# EAGLE schematic BeagleBone_Black_Rev C EAGLE PCB (EAGLE 7.4.0), part 1 of 2

## Sheet 1 of 11
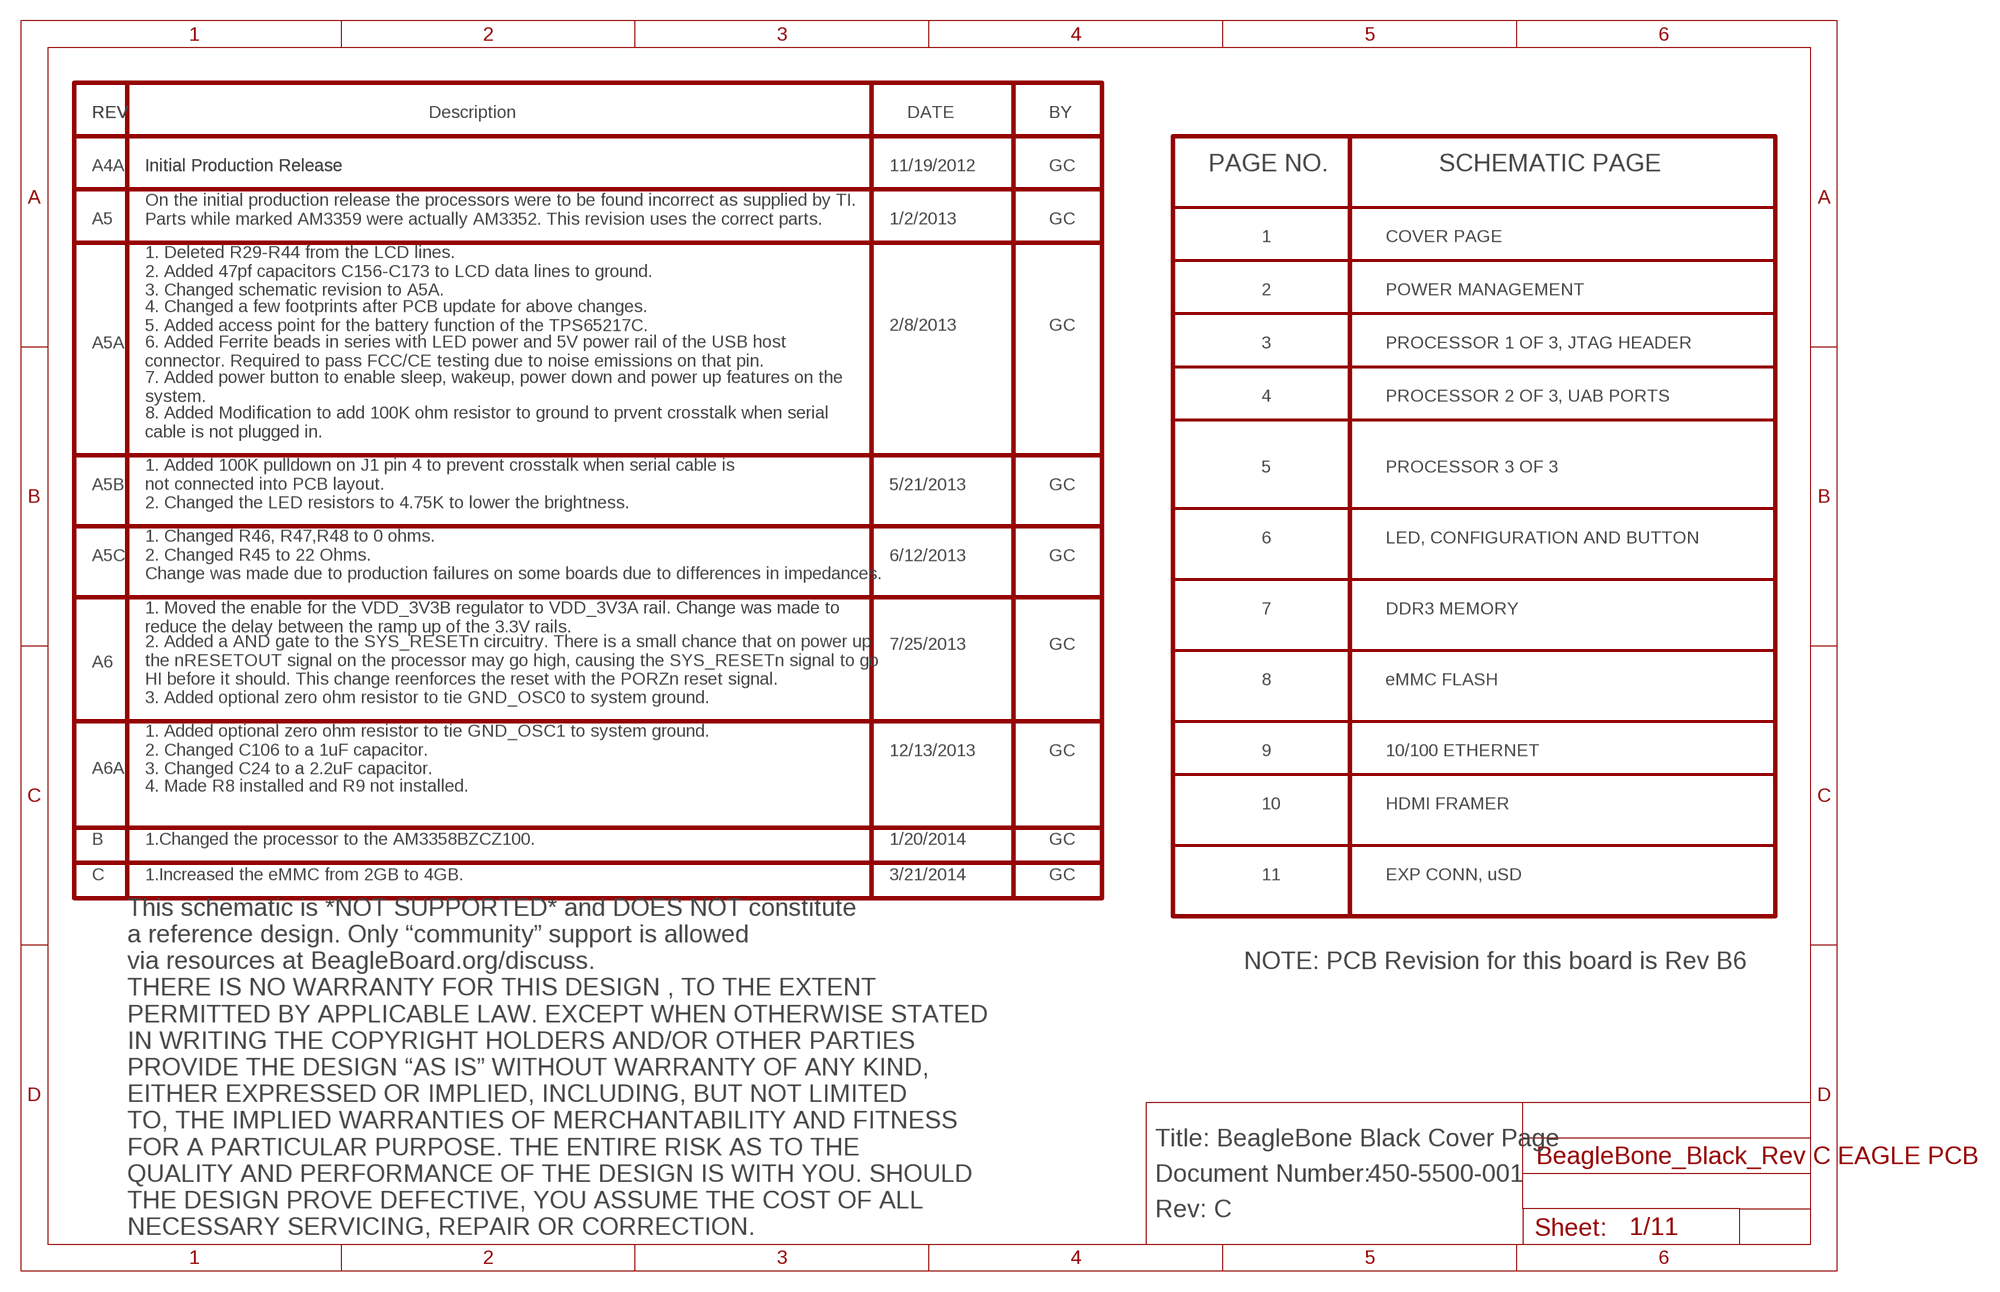
[diagram p0: schematic, sheet 1]

### Notes on the sheet
- REV | REV | Description | DATE | BY
- A4A | Initial Production Release | Initial Production Release | 11/19/2012 | GC | PAGE NO. | SCHEMATIC PAGE
- A5
- On the initial production release the processors were to be found incorrect as supplied by TI.
  Parts while marked AM3359 were actually AM3352. This revision uses the correct parts.
- 1/2/2013 | GC
- 1 | COVER PAGE
- 1. Deleted R29-R44 from the LCD lines.
  2. Added 47pf capacitors C156-C173 to LCD data lines to ground.
  3. Changed schematic revision to A5A.
- 2 | POWER MANAGEMENT
- 4. Changed a few footprints after PCB update for above changes.
  5. Added access point for the battery function of the TPS65217C.
- 2/8/2013 | GC
- A5A | 3 | PROCESSOR 1 OF 3, JTAG HEADER
- 6. Added Ferrite beads in series with LED power and 5V power rail of the USB host
  connector. Required to pass FCC/CE testing due to noise emissions on that pin.
- 7. Added power button to enable sleep, wakeup, power down and power up features on the
  system.
- 4 | PROCESSOR 2 OF 3, UAB PORTS
- 8. Added Modification to add 100K ohm resistor to ground to prvent crosstalk when serial
  cable is not plugged in.
- 5 | PROCESSOR 3 OF 3
- A5B | 5/21/2013 | GC
- 1. Added 100K pulldown on J1 pin 4 to prevent crosstalk when serial cable is
  not connected into PCB layout.
  2. Changed the LED resistors to 4.75K to lower the brightness.
- 6 | LED, CONFIGURATION AND BUTTON
- A5C | 6/12/2013 | GC
- 1. Changed R46, R47,R48 to 0 ohms.
  2. Changed R45 to 22 Ohms.
  Change was made due to production failures on some boards due to differences in impedances.
- 7 | DDR3 MEMORY
- 1. Moved the enable for the VDD_3V3B regulator to VDD_3V3A rail. Change was made to
  reduce the delay between the ramp up of the 3.3V rails.
- 7/25/2013 | GC
- A6
- 8 | eMMC FLASH
- 2. Added a AND gate to the SYS_RESETn circuitry. There is a small chance that on power up
  the nRESETOUT signal on the processor may go high, causing the SYS_RESETn signal to go
  HI before it should. This change reenforces the reset with the PORZn reset signal.
  3. Added optional zero ohm resistor to tie GND_OSC0 to system ground.
- 12/13/2013 | GC | 9 | 10/100 ETHERNET
- A6A
- 1. Added optional zero ohm resistor to tie GND_OSC1 to system ground.
  2. Changed C106 to a 1uF capacitor.
  3. Changed C24 to a 2.2uF capacitor.
- 4. Made R8 installed and R9 not installed.
- 10 | HDMI FRAMER
- B | 1.Changed the processor to the AM3358BZCZ100. | 1/20/2014 | GC
- C | 1.Increased the eMMC from 2GB to 4GB. | 3/21/2014 | GC | 11 | EXP CONN, uSD
- NOTE: PCB Revision for this board is Rev B6
- Title: BeagleBone Black Cover Page
- Document Number: | 450-5500-001
- Rev: C
- This schematic is *NOT SUPPORTED* and DOES NOT constitute
  a reference design. Only “community” support is allowed
  via resources at BeagleBoard.org/discuss.
  THERE IS NO WARRANTY FOR THIS DESIGN , TO THE EXTENT
  PERMITTED BY APPLICABLE LAW. EXCEPT WHEN OTHERWISE STATED
  IN WRITING THE COPYRIGHT HOLDERS AND/OR OTHER PARTIES
  PROVIDE THE DESIGN “AS IS” WITHOUT WARRANTY OF ANY KIND,
  EITHER EXPRESSED OR IMPLIED, INCLUDING, BUT NOT LIMITED
  TO, THE IMPLIED WARRANTIES OF MERCHANTABILITY AND FITNESS
  FOR A PARTICULAR PURPOSE. THE ENTIRE RISK AS TO THE
  QUALITY AND PERFORMANCE OF THE DESIGN IS WITH YOU. SHOULD
  THE DESIGN PROVE DEFECTIVE, YOU ASSUME THE COST OF ALL
  NECESSARY SERVICING, REPAIR OR CORRECTION.

## Sheet 2 of 11
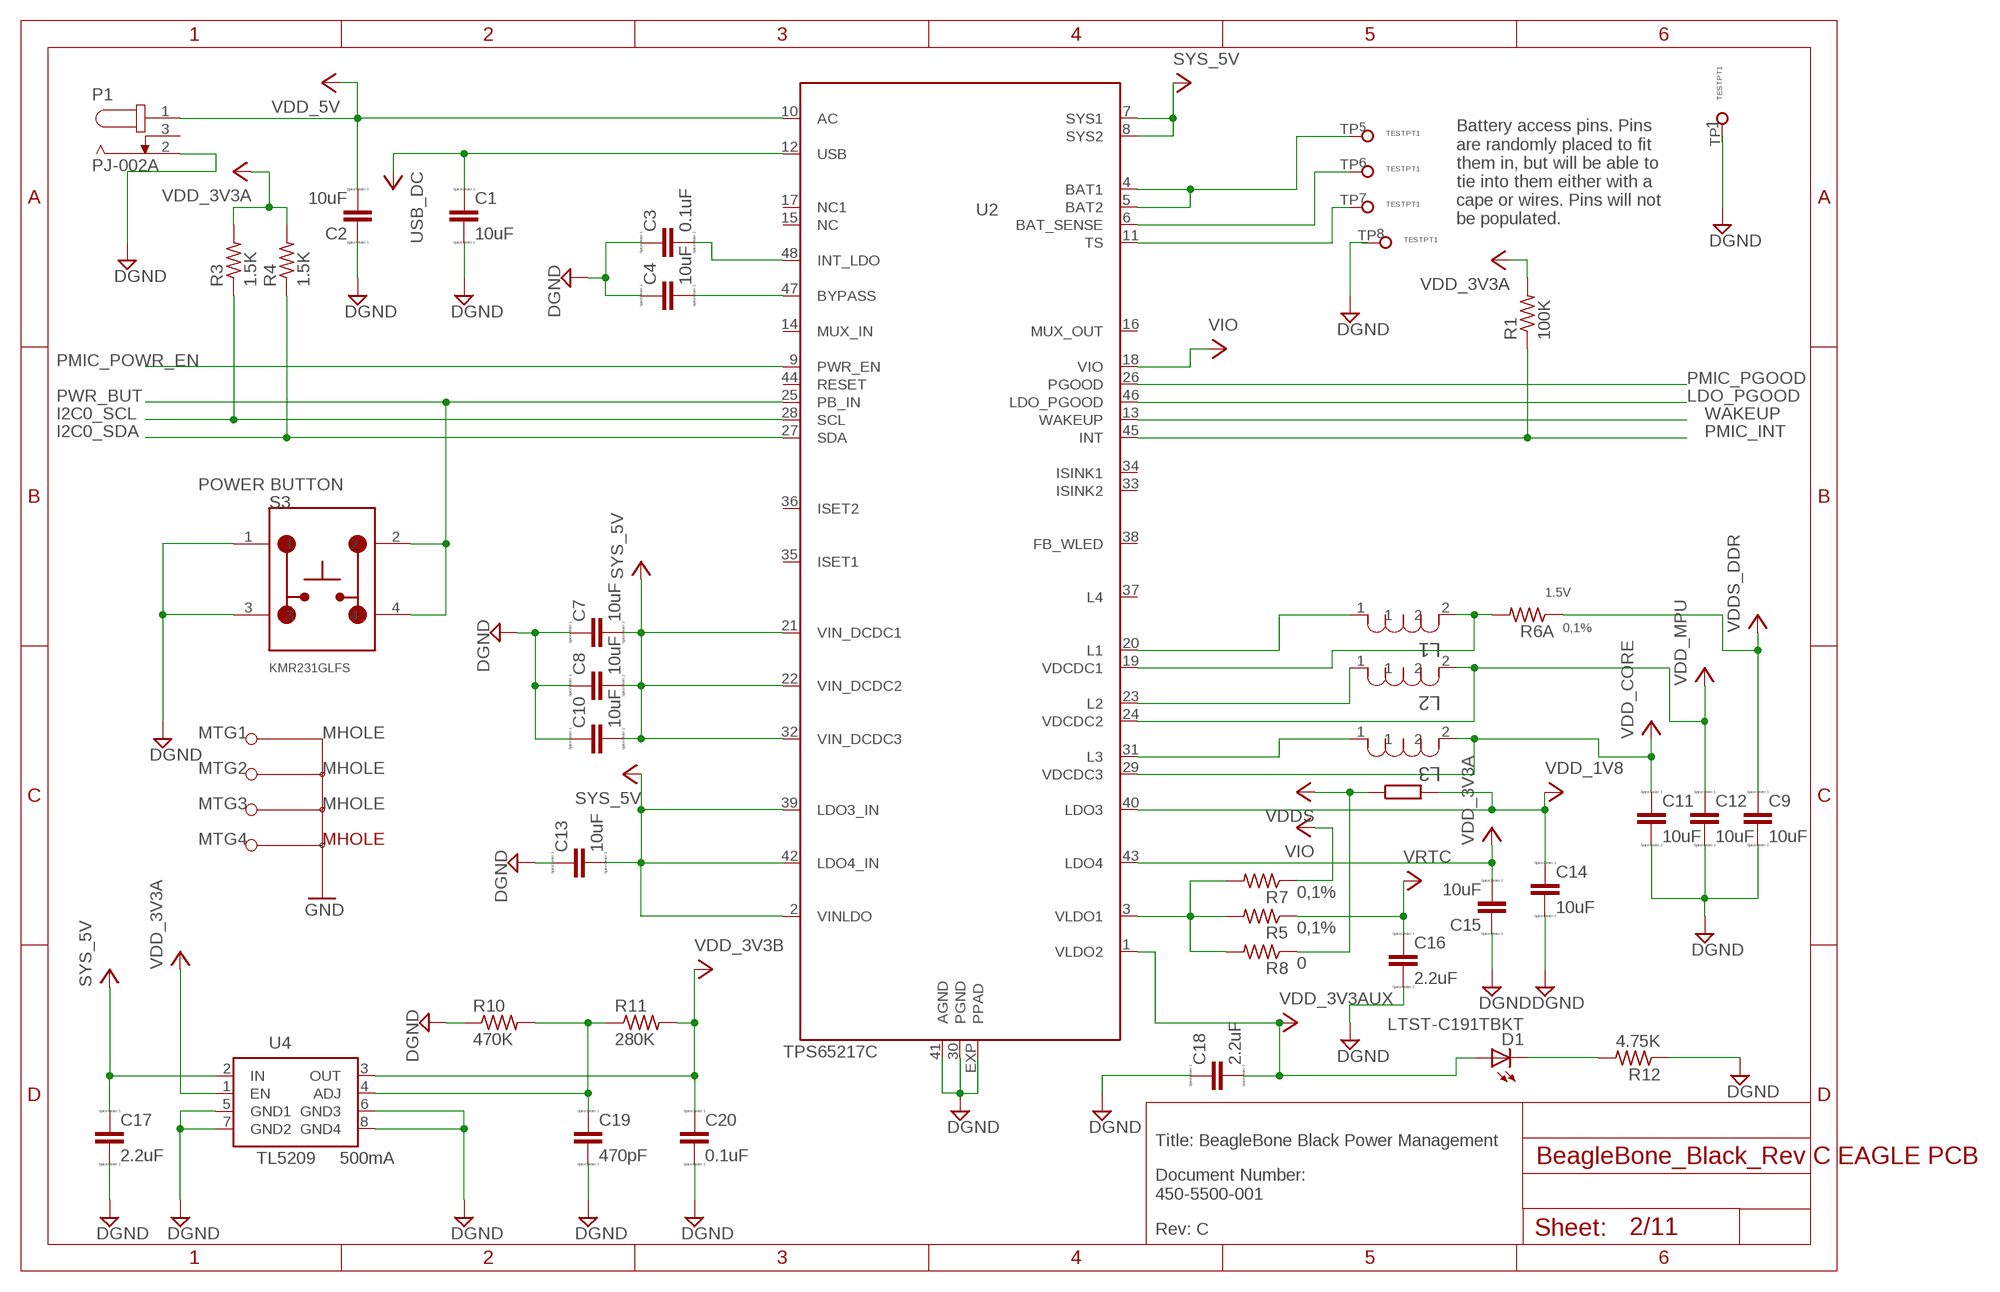
[diagram p1: schematic, sheet 2]

### Parts
C1  10uF  C  [C0805]
C2  10uF  C  [C0805]
C3  0.1uF  CC0402  [C0402]
C4  10uF  C  [C0805]
C7  10uF  C  [C0805]
C8  10uF  C  [C0805]
C9  10uF  C  [C0805]
C10  10uF  C  [C0805]
C11  10uF  C  [C0805]
C12  10uF  C  [C0805]
C13  10uF  C  [C0805]
C14  10uF  C  [C0805]
C15  10uF  C  [C0805]
C16  2.2uF  CC0402  [C0402]
C17  2.2uF  CC0402  [C0402]
C18  2.2uF  CC0402  [C0402]
C19  470pF  CC0402  [C0402]
C20  0.1uF  CC0402  [C0402]
D1  LTST-C191TBKT  LEDSML0603  [SML0603]
L1  LQM2HPN2RMG0L  [LQM2HPN2R2MG0L]
L2  LQM2HPN2RMG0L  [LQM2HPN2R2MG0L]
L3  LQM2HPN2RMG0L  [LQM2HPN2R2MG0L]
R1  100K  R-US_R0402  [R0402]
R3  1.5K  R-US_R0402  [R0402]
R4  1.5K  R-US_R0402  [R0402]
R5  R-US_R0402  [R0402]
R6A  R-US_R0402  [R0402]
R7  R-US_R0402  [R0402]
R8  R-US_R0402  [R0402]
R10  470K  R-US_R0402  [R0402]
R11  280K  R-US_R0402  [R0402]
R12  4.75K  R-US_R0402  [R0402]
S3  KMR231GLFS  [KMR231GLFS]
TP5  TESTPOINT  [TESTPOINT]
TP6  TESTPOINT  [TESTPOINT]
TP7  TESTPOINT  [TESTPOINT]
TP8  TESTPOINT  [TESTPOINT]
TP12  TESTPOINT  [TESTPOINT]
U4  TL5209  [TL5209]
U$1  PJ-002A  [PJ-002A]
U$3  TPS65217C  [TPS65217C]

### Nets
GND: C1.2 C2.1 C3.1 C4.1 C7.1 C8.1 C9.2 C10.1 C11.2 C12.2 C13.1 C14.2 C15.1 C16.2 C17.2 C18.1 C19.2 C20.2 R10.1 R12.1 S3.1 S3.3 U4.5(GND1) U4.6(GND3) U4.7(GND2) U4.8(GND4) U$1.2 U$3.30(PGND) U$3.41(AGND) U$3.EXP(PPAD) ; supply symbol labelled DGND ; also sheet 3,4,5,6,7,8,9,10,11
I2C0_SCL: R3.1 U$3.28(SCL) ; also sheet 4,10,11
I2C0_SDA: R4.1 U$3.27(SDA) ; also sheet 4,10,11
LDO_PGOOD: U$3.46(LDO_PGOOD) ; also sheet 3
N$1: C3.2 U$3.48(INT_LDO)
N$2: C19.1 R10.2 R11.1 U4.4(ADJ)
N$3: C4.2 U$3.47(BYPASS)
N$5: U$3.4(BAT1) U$3.5(BAT2)
N$8: L1.1 U$3.20(L1)
N$9: R5.2 R7.2 R8.2 U$3.3(VLDO1)
N$10: U$3.6(BAT_SENSE)
N$11: U$3.11(TS)
N$17: D1.C R12.2
N$19: L3.1 U$3.31(L3)
N$464: L1.2 R6A.2 U$3.19(VDCDC1)
N$465: L2.1 U$3.23(L2)
PMIC_INT: R1.1 U$3.45(INT) ; also sheet 3
PMIC_PGOOD: U$3.26(PGOOD) ; also sheet 3
PMIC_POWR_EN: U$3.9(PWR_EN) ; also sheet 4
PWR_BUT: S3.2 S3.4 U$3.25(PB_IN) ; also sheet 11
VCC: C1.1 C2.2 C7.2 C8.2 C9.1 C10.2 C11.1 C12.1 C13.2 C14.1 C15.2 C16.1 C17.1 C18.2 C20.1 D1.A L2.2 L3.2 R1.2 R3.2 R4.2 R5.1 R6A.1 R7.1 R8.1 R11.2 U4.1(EN) U4.2(IN) U4.3(OUT) U$1.1 U$3.1(VLDO2) U$3.2(VINLDO) U$3.7(SYS1) U$3.8(SYS2) U$3.10(AC) U$3.12(USB) U$3.18(VIO) U$3.21(VIN_DCDC1) U$3.22(VIN_DCDC2) U$3.24(VDCDC2) U$3.29(VDCDC3) U$3.32(VIN_DCDC3) U$3.39(LDO3_IN) U$3.40(LDO3) U$3.42(LDO4_IN) U$3.43(LDO4) ; supply symbol labelled SYS_5V, VDD_3V3A, VDD_3V3B, VDD_5V, USB_DC, VIO, VRTC, VDDS, VDD_1V8, VDD_CORE, VDD_MPU, VDDS_DDR, VDD_3V3AUX ; also sheet 3,4,5,6,7,8,9,10,11
WAKEUP: U$3.13(WAKEUP) ; also sheet 4
Unconnected: TP5.TP TP6.TP TP7.TP TP8.TP TP12.TP U$1.3 U$3.14(MUX_IN) U$3.15(NC) U$3.16(MUX_OUT) U$3.17(NC1) U$3.33(ISINK2) U$3.34(ISINK1) U$3.35(ISET1) U$3.36(ISET2) U$3.37(L4) U$3.38(FB_WLED) U$3.44(RESET)

### Notes on the sheet
- 5 | 1
- 6
- 7
- Battery access pins. Pins
  are randomly placed to fit
  them in, but will be able to
  tie into them either with a
  cape or wires. Pins will not
  be populated.
- 8
- POWER BUTTON
- S3
- 1.5V
- 0,1%
- MTG1 | MHOLE
- MTG2 | MHOLE
- MTG3 | MHOLE
- MTG4 | MHOLE
- 0,1%
- 0,1%
- 0
- TPS65217C
- Title: BeagleBone Black Power Management
- 500mA
- Document Number:
  450-5500-001
- Rev: C

## Sheet 3 of 11
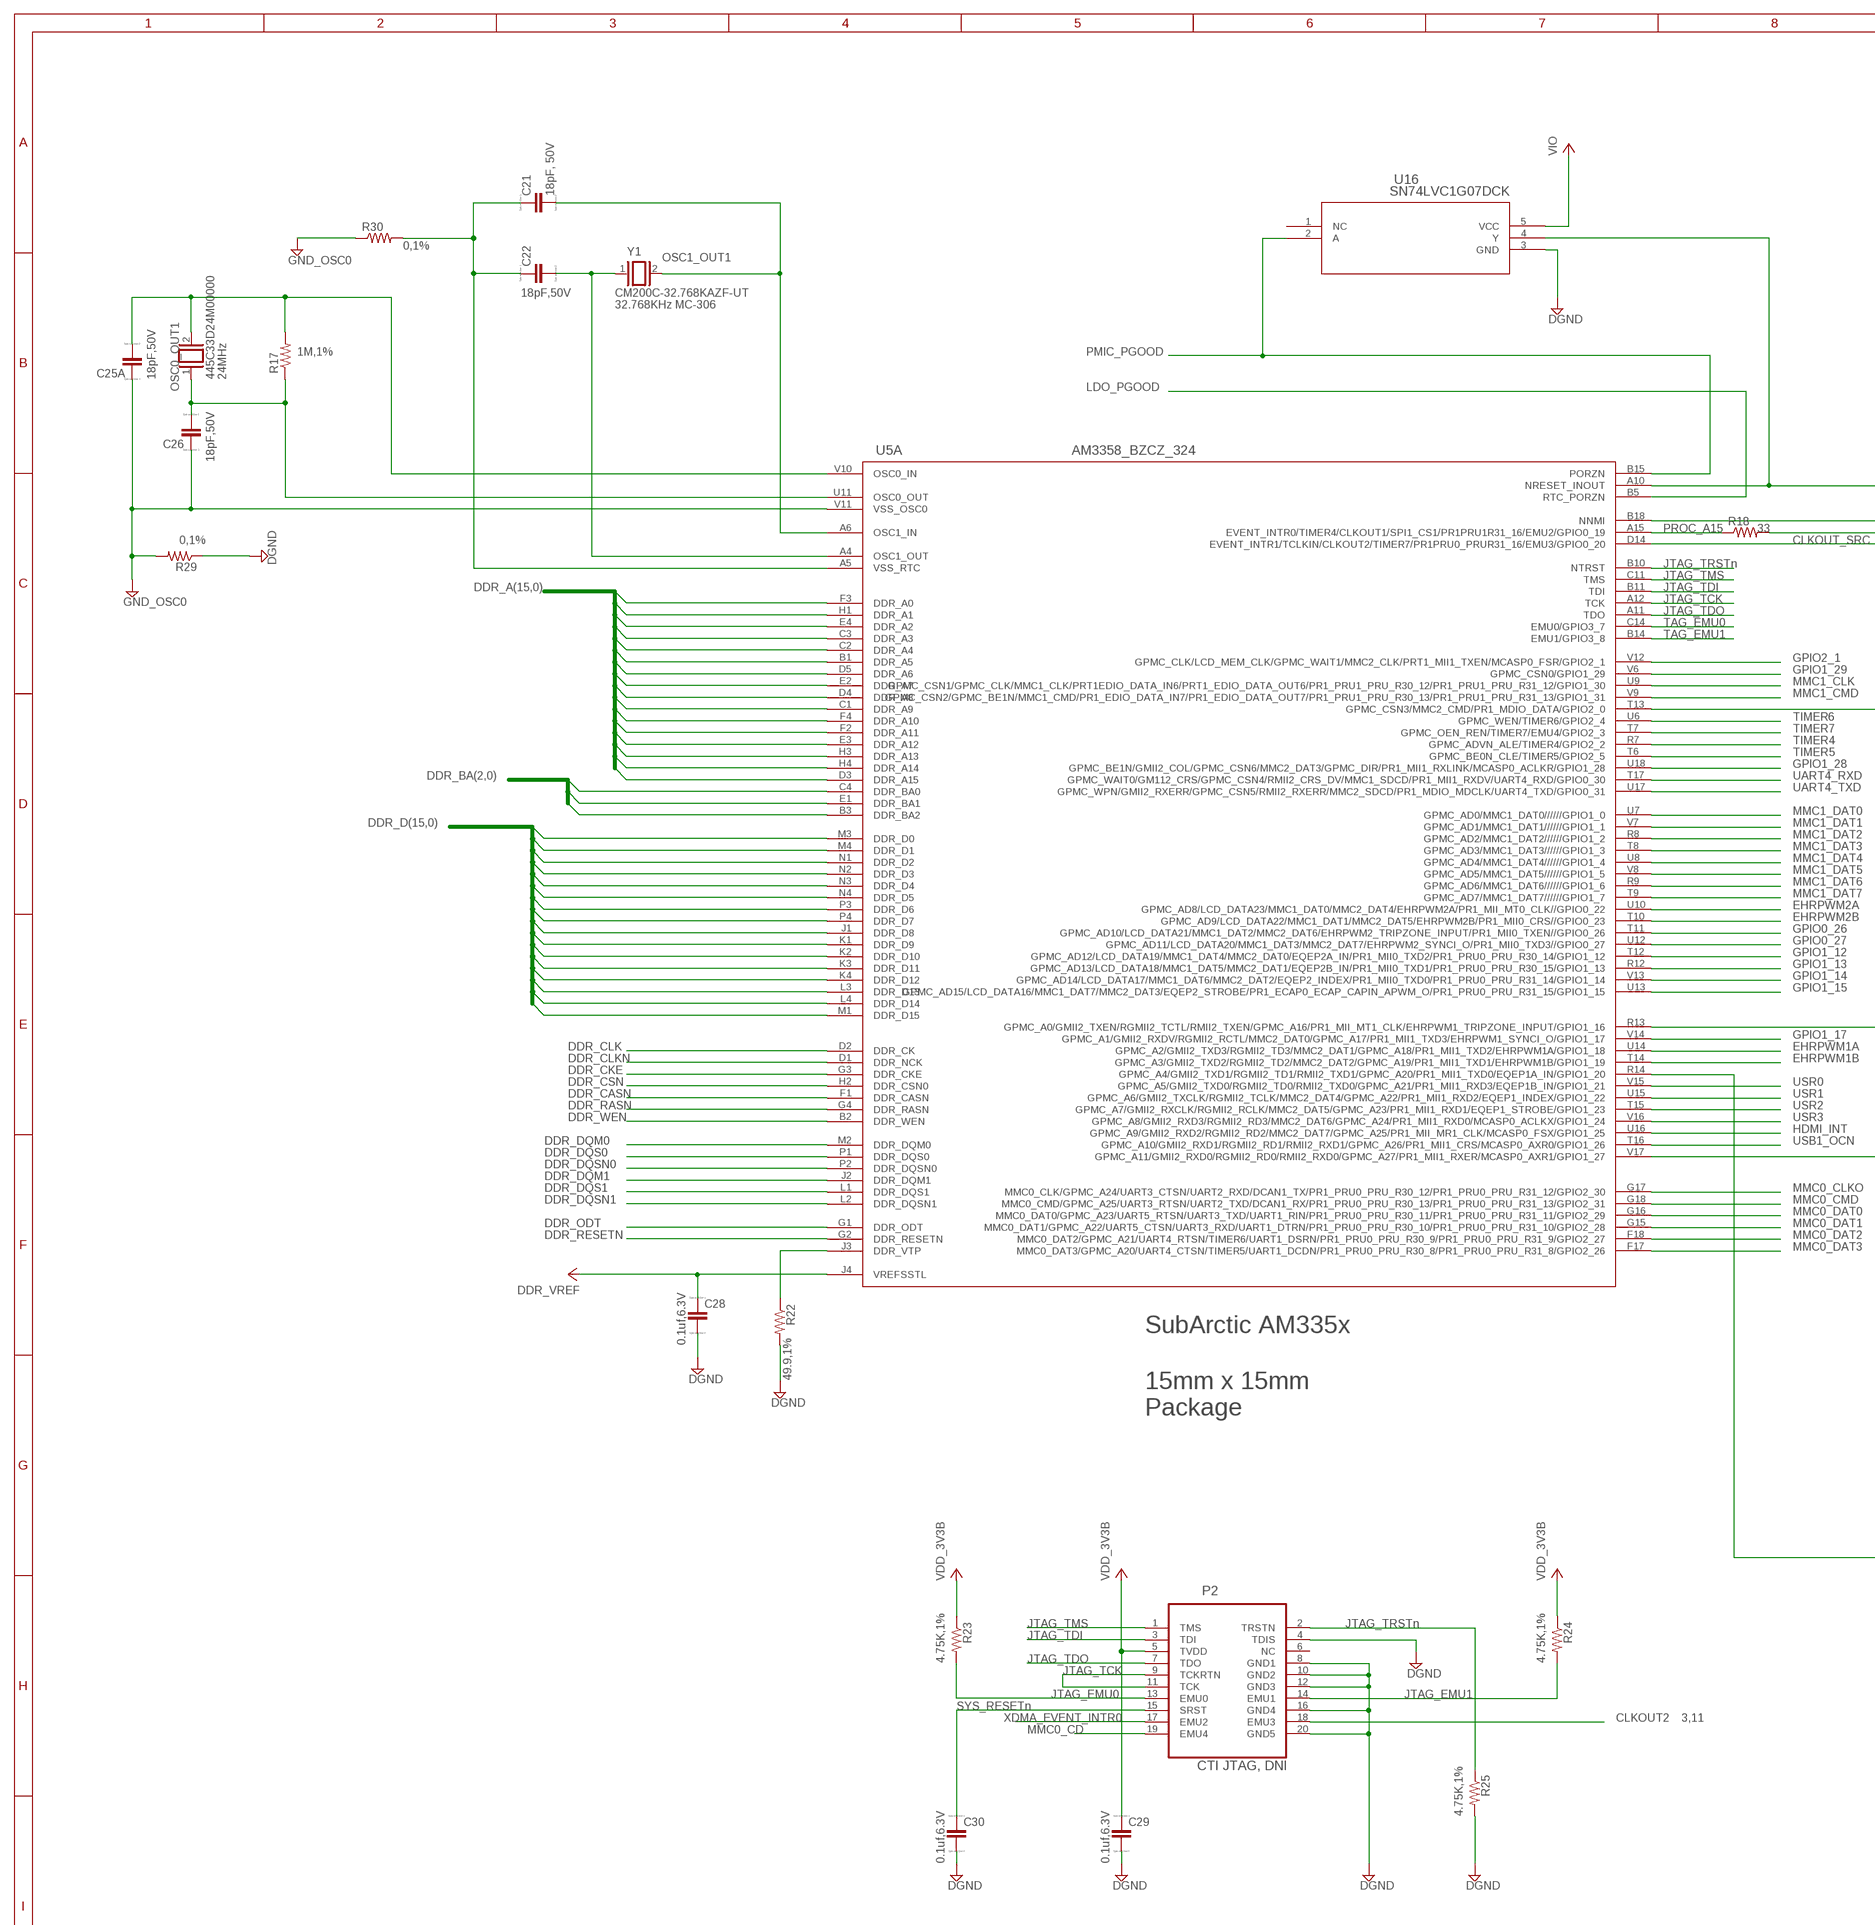
[diagram p2: schematic, sheet 3, part 1 of 2]
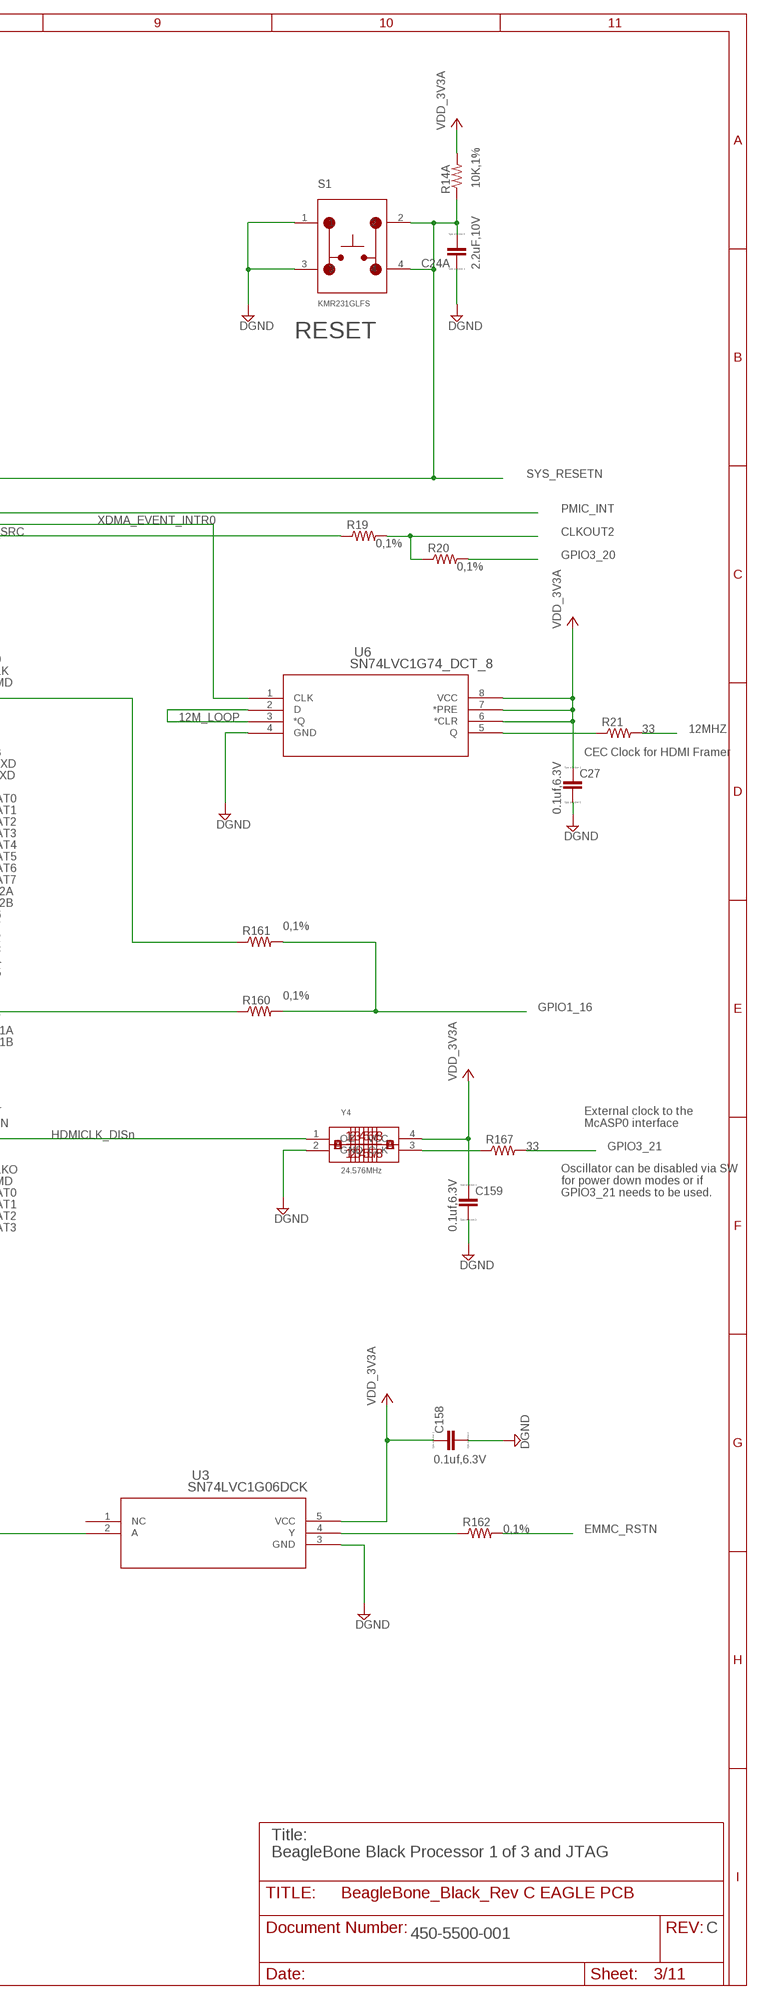
[diagram p3: schematic, sheet 3, part 2 of 2]

### Parts
C21  18pF, 50V  CC0402  [C0402]
C22  CC0402  [C0402]
C24A  CC0402  [C0402]
C25A  CC0402  [C0402]
C26  CC0402  [C0402]
C27  CC0402  [C0402]
C28  CC0402  [C0402]
C29  CC0402  [C0402]
C30  CC0402  [C0402]
C158  CC0402  [C0402]
C159  CC0402  [C0402]
P2  CTIJTAG  [CTIJTAG]
R14A  R-US_R0402  [R0402]
R17  R-US_R0402  [R0402]
R18  R-US_R0402  [R0402]
R19  R-US_R0402  [R0402]
R20  R-US_R0402  [R0402]
R21  R-US_R0402  [R0402]
R22  R-US_R0402  [R0402]
R23  R-US_R0402  [R0402]
R24  R-US_R0402  [R0402]
R25  R-US_R0402  [R0402]
R29  R-US_R0402  [R0402]
R30  R-US_R0402  [R0402]
R160  R-US_R0402  [R0402]
R161  R-US_R0402  [R0402]
R162  R-US_R0402  [R0402]
R167  R-US_R0402  [R0402]
S1  KMR231GLFS  [KMR231GLFS]
U3  SN74LVC1G06DCK  SN74LVC1G06_DCK_5  [DCK5]
U5  AM3358_BZCZ_324  [BZCZ324]
U6  SN74LVC1G74_DCT_8  [DCT8]
U16  SN74LVC1G07DCK  SN74LVC1G07_DCK_5  [DCK5]
Y1  CM200C-32.768KAZF-UT  [CM200C-32.768KAZF-UT]
Y2  445C33D24M00000  [445C33D24M00000]
Y4  ASDMB-24.576MHZ-LC-T  [ASDMB-24.576MHZ-LC-T]

### Nets
12MHZ: R21.2 ; also sheet 10
CLKOUT2: P2.18(EMU3) R19.2 R20.1 ; also sheet 11
DDR_A(15,0): U5.B1(DDR_A5) U5.C1(DDR_A9) U5.C2(DDR_A4) U5.C3(DDR_A3) U5.D3(DDR_A15) U5.D4(DDR_A8) U5.D5(DDR_A6) U5.E2(DDR_A7) U5.E3(DDR_A12) U5.E4(DDR_A2) U5.F2(DDR_A11) U5.F3(DDR_A0) U5.F4(DDR_A10) U5.H1(DDR_A1) U5.H3(DDR_A13) U5.H4(DDR_A14) ; also sheet 7
DDR_BA(2,0): U5.B3(DDR_BA2) U5.C4(DDR_BA0) U5.E1(DDR_BA1) ; also sheet 7
DDR_CASN: U5.F1(DDR_CASN) ; also sheet 7
DDR_CKE: U5.G3(DDR_CKE) ; also sheet 7
DDR_CLK: U5.D2(DDR_CK) ; also sheet 7
DDR_CLKN: U5.D1(DDR_NCK) ; also sheet 7
DDR_CSN: U5.H2(DDR_CSN0) ; also sheet 7
DDR_D(15,0): U5.J1(DDR_D8) U5.K1(DDR_D9) U5.K2(DDR_D10) U5.K3(DDR_D11) U5.K4(DDR_D12) U5.L3(DDR_D13) U5.L4(DDR_D14) U5.M1(DDR_D15) U5.M3(DDR_D0) U5.M4(DDR_D1) U5.N1(DDR_D2) U5.N2(DDR_D3) U5.N3(DDR_D4) U5.N4(DDR_D5) U5.P3(DDR_D6) U5.P4(DDR_D7) ; also sheet 7
DDR_DQM0: U5.M2(DDR_DQM0) ; also sheet 7
DDR_DQM1: U5.J2(DDR_DQM1) ; also sheet 7
DDR_DQS0: U5.P1(DDR_DQS0) ; also sheet 7
DDR_DQS1: U5.L1(DDR_DQS1) ; also sheet 7
DDR_DQSN0: U5.P2(DDR_DQSN0) ; also sheet 7
DDR_DQSN1: U5.L2(DDR_DQSN1) ; also sheet 7
DDR_ODT: U5.G1(DDR_ODT) ; also sheet 7
DDR_RASN: U5.G4(DDR_RASN) ; also sheet 7
DDR_RESETN: U5.G2(DDR_RESETN) ; also sheet 7
DDR_WEN: U5.B2(DDR_WEN) ; also sheet 7
EHRPWM1A: U5.U14(GPMC_A2/GMII2_TXD3/RGMII2_TD3/MMC2_DAT1/GPMC_A18/PR1_MII1_TXD2/EHRPWM1A/GPIO1_18) ; also sheet 11
EHRPWM1B: U5.T14(GPMC_A3/GMII2_TXD2/RGMII2_TD2/MMC2_DAT2/GPMC_A19/PR1_MII1_TXD1/EHRPWM1B/GPIO1_19) ; also sheet 11
EHRPWM2A: U5.U10(GPMC_AD8/LCD_DATA23/MMC1_DAT0/MMC2_DAT4/EHRPWM2A/PR1_MII_MT0_CLK//GPIO0_22) ; also sheet 11
EHRPWM2B: U5.T10(GPMC_AD9/LCD_DATA22/MMC1_DAT1/MMC2_DAT5/EHRPWM2B/PR1_MII0_CRS//GPIO0_23) ; also sheet 11
EMMC_RSTN: R162.2 ; also sheet 8
GND: C24A.1 C25A.1 C26.1 C27.2 C28.2 C29.2 C30.2 C158.2 C159.2 P2.4(TDIS) P2.8(GND1) P2.10(GND2) P2.12(GND3) P2.16(GND4) P2.20(GND5) R22.2 R25.2 R29.1 R29.2 R30.1 S1.1 S1.3 U3.3(GND) U5.V11(VSS_OSC0) U6.4(GND) U16.3(GND) Y4.2(GND) ; supply symbol labelled DGND, GND_OSC0 ; also sheet 2,4,5,6,7,8,9,10,11
GPIO0_26: U5.T11(GPMC_AD10/LCD_DATA21/MMC1_DAT2/MMC2_DAT6/EHRPWM2_TRIPZONE_INPUT/PR1_MII0_TXEN//GPIO0_26) ; also sheet 11
GPIO0_27: U5.U12(GPMC_AD11/LCD_DATA20/MMC1_DAT3/MMC2_DAT7/EHRPWM2_SYNCI_O/PR1_MII0_TXD3//GPIO0_27) ; also sheet 11
GPIO1_12: U5.T12(GPMC_AD12/LCD_DATA19/MMC1_DAT4/MMC2_DAT0/EQEP2A_IN/PR1_MII0_TXD2/PR1_PRU0_PRU_R30_14/GPIO1_12) ; also sheet 11
GPIO1_13: U5.R12(GPMC_AD13/LCD_DATA18/MMC1_DAT5/MMC2_DAT1/EQEP2B_IN/PR1_MII0_TXD1/PR1_PRU0_PRU_R30_15/GPIO1_13) ; also sheet 11
GPIO1_14: U5.V13(GPMC_AD14/LCD_DATA17/MMC1_DAT6/MMC2_DAT2/EQEP2_INDEX/PR1_MII0_TXD0/PR1_PRU0_PRU_R31_14/GPIO1_14) ; also sheet 11
GPIO1_15: U5.U13(GPMC_AD15/LCD_DATA16/MMC1_DAT7/MMC2_DAT3/EQEP2_STROBE/PR1_ECAP0_ECAP_CAPIN_APWM_O/PR1_PRU0_PRU_R31_15/GPIO1_15) ; also sheet 11
GPIO1_16: R160.2 R161.2 ; also sheet 11
GPIO1_17: U5.V14(GPMC_A1/GMII2_RXDV/RGMII2_RCTL/MMC2_DAT0/GPMC_A17/PR1_MII1_TXD3/EHRPWM1_SYNCI_O/GPIO1_17) ; also sheet 11
GPIO1_28: U5.U18(GPMC_BE1N/GMII2_COL/GPMC_CSN6/MMC2_DAT3/GPMC_DIR/PR1_MII1_RXLINK/MCASP0_ACLKR/GPIO1_28) ; also sheet 11
GPIO1_29: U5.V6(GPMC_CSN0/GPIO1_29) ; also sheet 11
GPIO2_1: U5.V12(GPMC_CLK/LCD_MEM_CLK/GPMC_WAIT1/MMC2_CLK/PRT1_MII1_TXEN/MCASP0_FSR/GPIO2_1) ; also sheet 11
GPIO3_20: R20.2 ; also sheet 4
GPIO3_21: R167.2 ; also sheet 4,11
HDMI_INT: U5.U16(GPMC_A9/GMII2_RXD2/RGMII2_RD2/MMC2_DAT7/GPMC_A25/PR1_MII_MR1_CLK/MCASP0_FSX/GPIO1_25) ; also sheet 10
LDO_PGOOD: U5.B5(RTC_PORZN) ; also sheet 2
MMC0_CD: P2.19(EMU4) ; also sheet 4,11
MMC0_CLKO: U5.G17(MMC0_CLK/GPMC_A24/UART3_CTSN/UART2_RXD/DCAN1_TX/PR1_PRU0_PRU_R30_12/PR1_PRU0_PRU_R31_12/GPIO2_30)
MMC0_CMD: U5.G18(MMC0_CMD/GPMC_A25/UART3_RTSN/UART2_TXD/DCAN1_RX/PR1_PRU0_PRU_R30_13/PR1_PRU0_PRU_R31_13/GPIO2_31) ; also sheet 11
MMC0_DAT0: U5.G16(MMC0_DAT0/GPMC_A23/UART5_RTSN/UART3_TXD/UART1_RIN/PR1_PRU0_PRU_R30_11/PR1_PRU0_PRU_R31_11/GPIO2_29) ; also sheet 11
MMC0_DAT1: U5.G15(MMC0_DAT1/GPMC_A22/UART5_CTSN/UART3_RXD/UART1_DTRN/PR1_PRU0_PRU_R30_10/PR1_PRU0_PRU_R31_10/GPIO2_28) ; also sheet 11
MMC0_DAT2: U5.F18(MMC0_DAT2/GPMC_A21/UART4_RTSN/TIMER6/UART1_DSRN/PR1_PRU0_PRU_R30_9/PR1_PRU0_PRU_R31_9/GPIO2_27) ; also sheet 11
MMC0_DAT3: U5.F17(MMC0_DAT3/GPMC_A20/UART4_CTSN/TIMER5/UART1_DCDN/PR1_PRU0_PRU_R30_8/PR1_PRU0_PRU_R31_8/GPIO2_26) ; also sheet 11
MMC1_CLK: U5.U9(GPMC_CSN1/GPMC_CLK/MMC1_CLK/PRT1EDIO_DATA_IN6/PRT1_EDIO_DATA_OUT6/PR1_PRU1_PRU_R30_12/PR1_PRU1_PRU_R31_12/GPIO1_30) ; also sheet 8,11
MMC1_CMD: U5.V9(GPMC_CSN2/GPMC_BE1N/MMC1_CMD/PR1_EDIO_DATA_IN7/PR1_EDIO_DATA_OUT7/PR1_PRU1_PRU_R30_13/PR1_PRU1_PRU_R31_13/GPIO1_31) ; also sheet 8,11
MMC1_DAT0: U5.U7(GPMC_AD0/MMC1_DAT0//////GPIO1_0) ; also sheet 8,11
MMC1_DAT1: U5.V7(GPMC_AD1/MMC1_DAT1//////GPIO1_1) ; also sheet 8,11
MMC1_DAT2: U5.R8(GPMC_AD2/MMC1_DAT2//////GPIO1_2) ; also sheet 8,11
MMC1_DAT3: U5.T8(GPMC_AD3/MMC1_DAT3//////GPIO1_3) ; also sheet 8,11
MMC1_DAT4: U5.U8(GPMC_AD4/MMC1_DAT4//////GPIO1_4) ; also sheet 8,11
MMC1_DAT5: U5.V8(GPMC_AD5/MMC1_DAT5//////GPIO1_5) ; also sheet 8,11
MMC1_DAT6: U5.R9(GPMC_AD6/MMC1_DAT6//////GPIO1_6) ; also sheet 8,11
MMC1_DAT7: U5.T9(GPMC_AD7/MMC1_DAT7//////GPIO1_7) ; also sheet 8,11
N$22: R22.1 U5.J3(DDR_VTP)
N$71: C21.2 U5.A6(OSC1_IN) Y1.2
N$72: C22.2 U5.A4(OSC1_OUT) Y1.1
N$73: C21.1 C22.1 R30.2 U5.A5(VSS_RTC)
N$74: C25A.2 R17.2 U5.V10(OSC0_IN) Y2.2
N$76: C26.2 R17.1 U5.U11(OSC0_OUT) Y2.1
N$80: U6.2(D) U6.3(*Q)
N$81: R21.1 U6.5(Q)
N$82: R18.1 U5.A15(EVENT_INTR0/TIMER4/CLKOUT1/SPI1_CS1/PR1PRU1R31_16/EMU2/GPIO0_19)
N$83: R18.2 U6.1(CLK)
N$85: R19.1 U5.D14(EVENT_INTR1/TCLKIN/CLKOUT2/TIMER7/PR1PRU0_PRUR31_16/EMU3/GPIO0_20)
N$88: U5.B10(NTRST)
N$89: U5.C11(TMS)
N$90: U5.B11(TDI)
N$91: U5.A12(TCK)
N$92: U5.A11(TDO)
N$93: U5.C14(EMU0/GPIO3_7)
N$94: U5.B14(EMU1/GPIO3_8)
N$122: R160.1 U5.R13(GPMC_A0/GMII2_TXEN/RGMII2_TCTL/RMII2_TXEN/GPMC_A16/PR1_MII_MT1_CLK/EHRPWM1_TRIPZONE_INPUT/GPIO1_16)
N$123: R161.1 U5.T13(GPMC_CSN3/MMC2_CMD/PR1_MDIO_DATA/GPIO2_0)
N$125: U5.V17(GPMC_A11/GMII2_RXD0/RGMII2_RD0/RMII2_RXD0/GPMC_A27/PR1_MII1_RXER/MCASP0_AXR1/GPIO1_27) Y4.1(OE)
N$128: R167.1 Y4.3(CLK)
N$143: U3.2(A) U5.R14(GPMC_A4/GMII2_TXD1/RGMII2_TD1/RMII2_TXD1/GPMC_A20/PR1_MII1_TXD0/EQEP1A_IN/GPIO1_20)
N$144: R162.1 U3.4(Y)
N$146: P2.9(TCKRTN) P2.11(TCK)
N$147: P2.14(EMU1) R24.2
N$149: P2.2(TRSTN) R25.1
N$150: P2.1(TMS)
N$151: P2.3(TDI)
N$152: P2.7(TDO)
N$153: P2.13(EMU0) R23.2
N$154: C30.1 P2.15(SRST)
N$155: P2.17(EMU2)
PMIC_INT: U5.B18(NNMI) ; also sheet 2
PMIC_PGOOD: U5.B15(PORZN) U16.2(A) ; also sheet 2
SYS_RESETN: C24A.2 R14A.1 S1.2 S1.4 U5.A10(NRESET_INOUT) U16.4(Y) ; also sheet 9,11
TIMER: U5.U6(GPMC_WEN/TIMER6/GPIO2_4)
TIMER4: U5.R7(GPMC_ADVN_ALE/TIMER4/GPIO2_2) ; also sheet 11
TIMER5: U5.T6(GPMC_BE0N_CLE/TIMER5/GPIO2_5) ; also sheet 11
TIMER7: U5.T7(GPMC_OEN_REN/TIMER7/EMU4/GPIO2_3) ; also sheet 11
UART4_RXD: U5.T17(GPMC_WAIT0/GM112_CRS/GPMC_CSN4/RMII2_CRS_DV/MMC1_SDCD/PR1_MII1_RXDV/UART4_RXD/GPIO0_30) ; also sheet 11
UART4_TXD: U5.U17(GPMC_WPN/GMII2_RXERR/GPMC_CSN5/RMII2_RXERR/MMC2_SDCD/PR1_MDIO_MDCLK/UART4_TXD/GPIO0_31) ; also sheet 11
USB1_OCN: U5.T16(GPMC_A10/GMII2_RXD1/RGMII2_RD1/RMII2_RXD1/GPMC_A26/PR1_MII1_CRS/MCASP0_AXR0/GPIO1_26) ; also sheet 4
USR0: U5.V15(GPMC_A5/GMII2_TXD0/RGMII2_TD0/RMII2_TXD0/GPMC_A21/PR1_MII1_RXD3/EQEP1B_IN/GPIO1_21) ; also sheet 6
USR1: U5.U15(GPMC_A6/GMII2_TXCLK/RGMII2_TCLK/MMC2_DAT4/GPMC_A22/PR1_MII1_RXD2/EQEP1_INDEX/GPIO1_22) ; also sheet 6
USR2: U5.T15(GPMC_A7/GMII2_RXCLK/RGMII2_RCLK/MMC2_DAT5/GPMC_A23/PR1_MII1_RXD1/EQEP1_STROBE/GPIO1_23) ; also sheet 6
USR3: U5.V16(GPMC_A8/GMII2_RXD3/RGMII2_RD3/MMC2_DAT6/GPMC_A24/PR1_MII1_RXD0/MCASP0_ACLKX/GPIO1_24) ; also sheet 6
VCC: C27.1 C28.1 C29.1 C158.1 C159.1 P2.5(TVDD) R14A.2 R23.1 R24.1 U3.5(VCC) U5.J4(VREFSSTL) U6.6(*CLR) U6.7(*PRE) U6.8(VCC) U16.5(VCC) Y4.4(VCC) ; supply symbol labelled VIO, VDD_3V3A, VDD_3V3B, DDR_VREF ; also sheet 2,4,5,6,7,8,9,10,11
Unconnected: P2.6(NC) U3.1(NC) U16.1(NC)

### Notes on the sheet
- S1 | 10K,1%
- 0,1%
- OSC1_OUT1
- 2.2uF,10V
- 18pF,50V
- 32.768KHz MC-306
- RESET
- 1M,1%
- 18pF,50V | 24MHz
- OSC0_OUT1
- 18pF,50V
- PROC_A15 | 33 | XDMA_EVENT_INTR0
- 0,1% | CLKOUT_SRC
- 0,1%
- JTAG_TRSTn
- JTAG_TMS | 0,1%
- JTAG_TDI
- JTAG_TCK
- JTAG_TDO
- TAG_EMU0
- TAG_EMU1
- 6
- 12M_LOOP
- 33
- CEC Clock for HDMI Framer
- 0.1uf,6.3V
- 0,1%
- 0,1%
- External clock to the
  McASP0 interface
- HDMICLK_DISn
- 33
- Oscillator can be disabled via SW
  for power down modes or if
  GPIO3_21 needs to be used.
- 0.1uf,6.3V
- SubArctic AM335x
- 0.1uf,6.3V
- 49.9,1%
- 15mm x 15mm
  Package
- 0.1uf,6.3V
- 0,1%
- JTAG_TMS | JTAG_TRSTn
- JTAG_TDI
- 4.75K,1% | JTAG_TDO | 4.75K,1%
- JTAG_TCK
- JTAG_EMU0 | JTAG_EMU1
- SYS_RESETn
- XDMA_EVENT_INTR0 | CLKOUT2    3,11
- MMC0_CD
- 4.75K,1%
- 0.1uf,6.3V | 0.1uf,6.3V
- Title:
  BeagleBone Black Processor 1 of 3 and JTAG
- C
- 450-5500-001

## Sheet 4 of 11
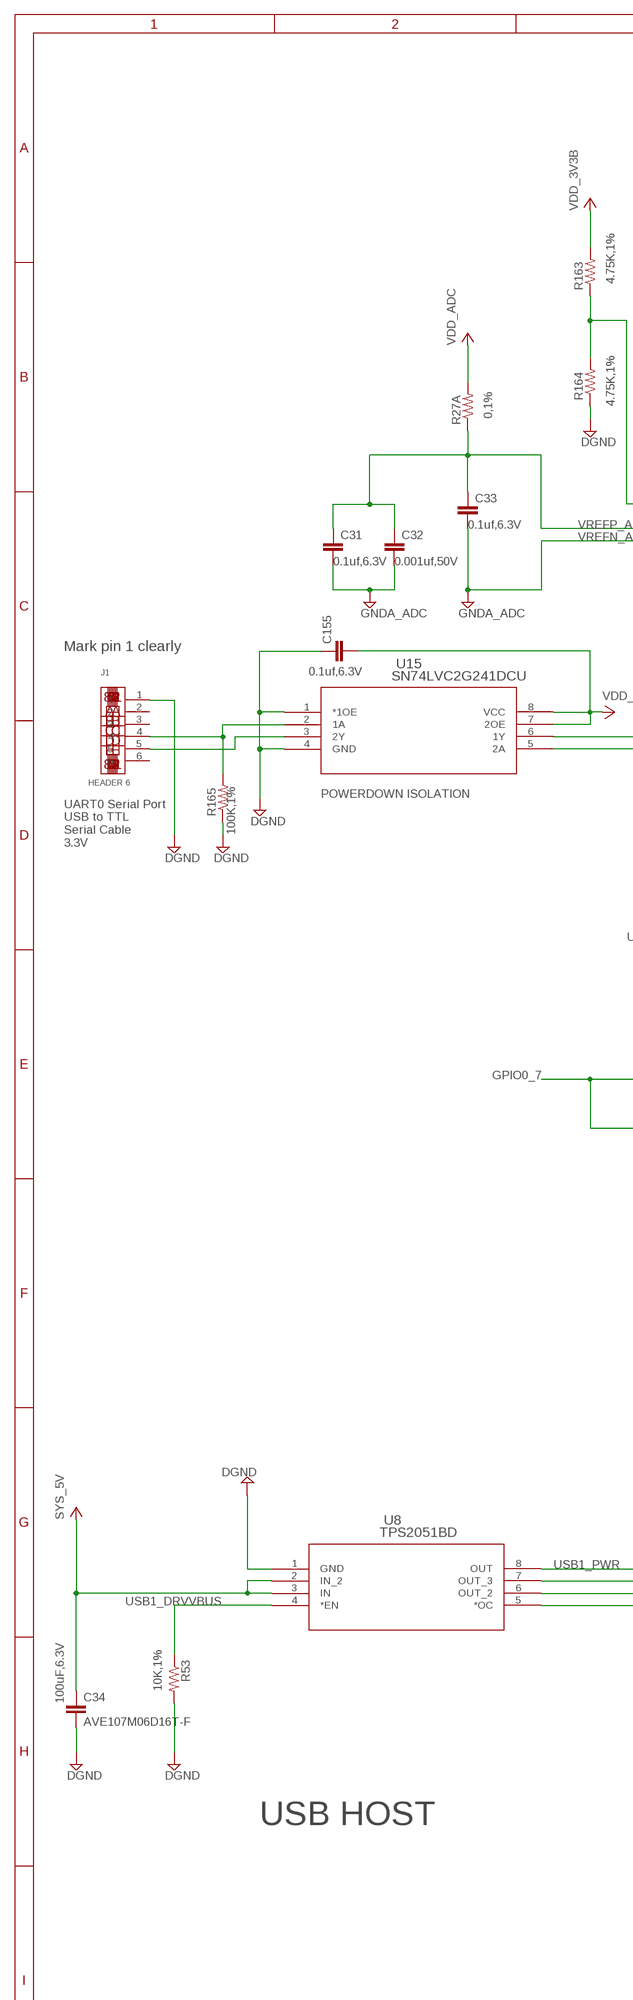
[diagram p4: schematic, sheet 4, part 1 of 2]
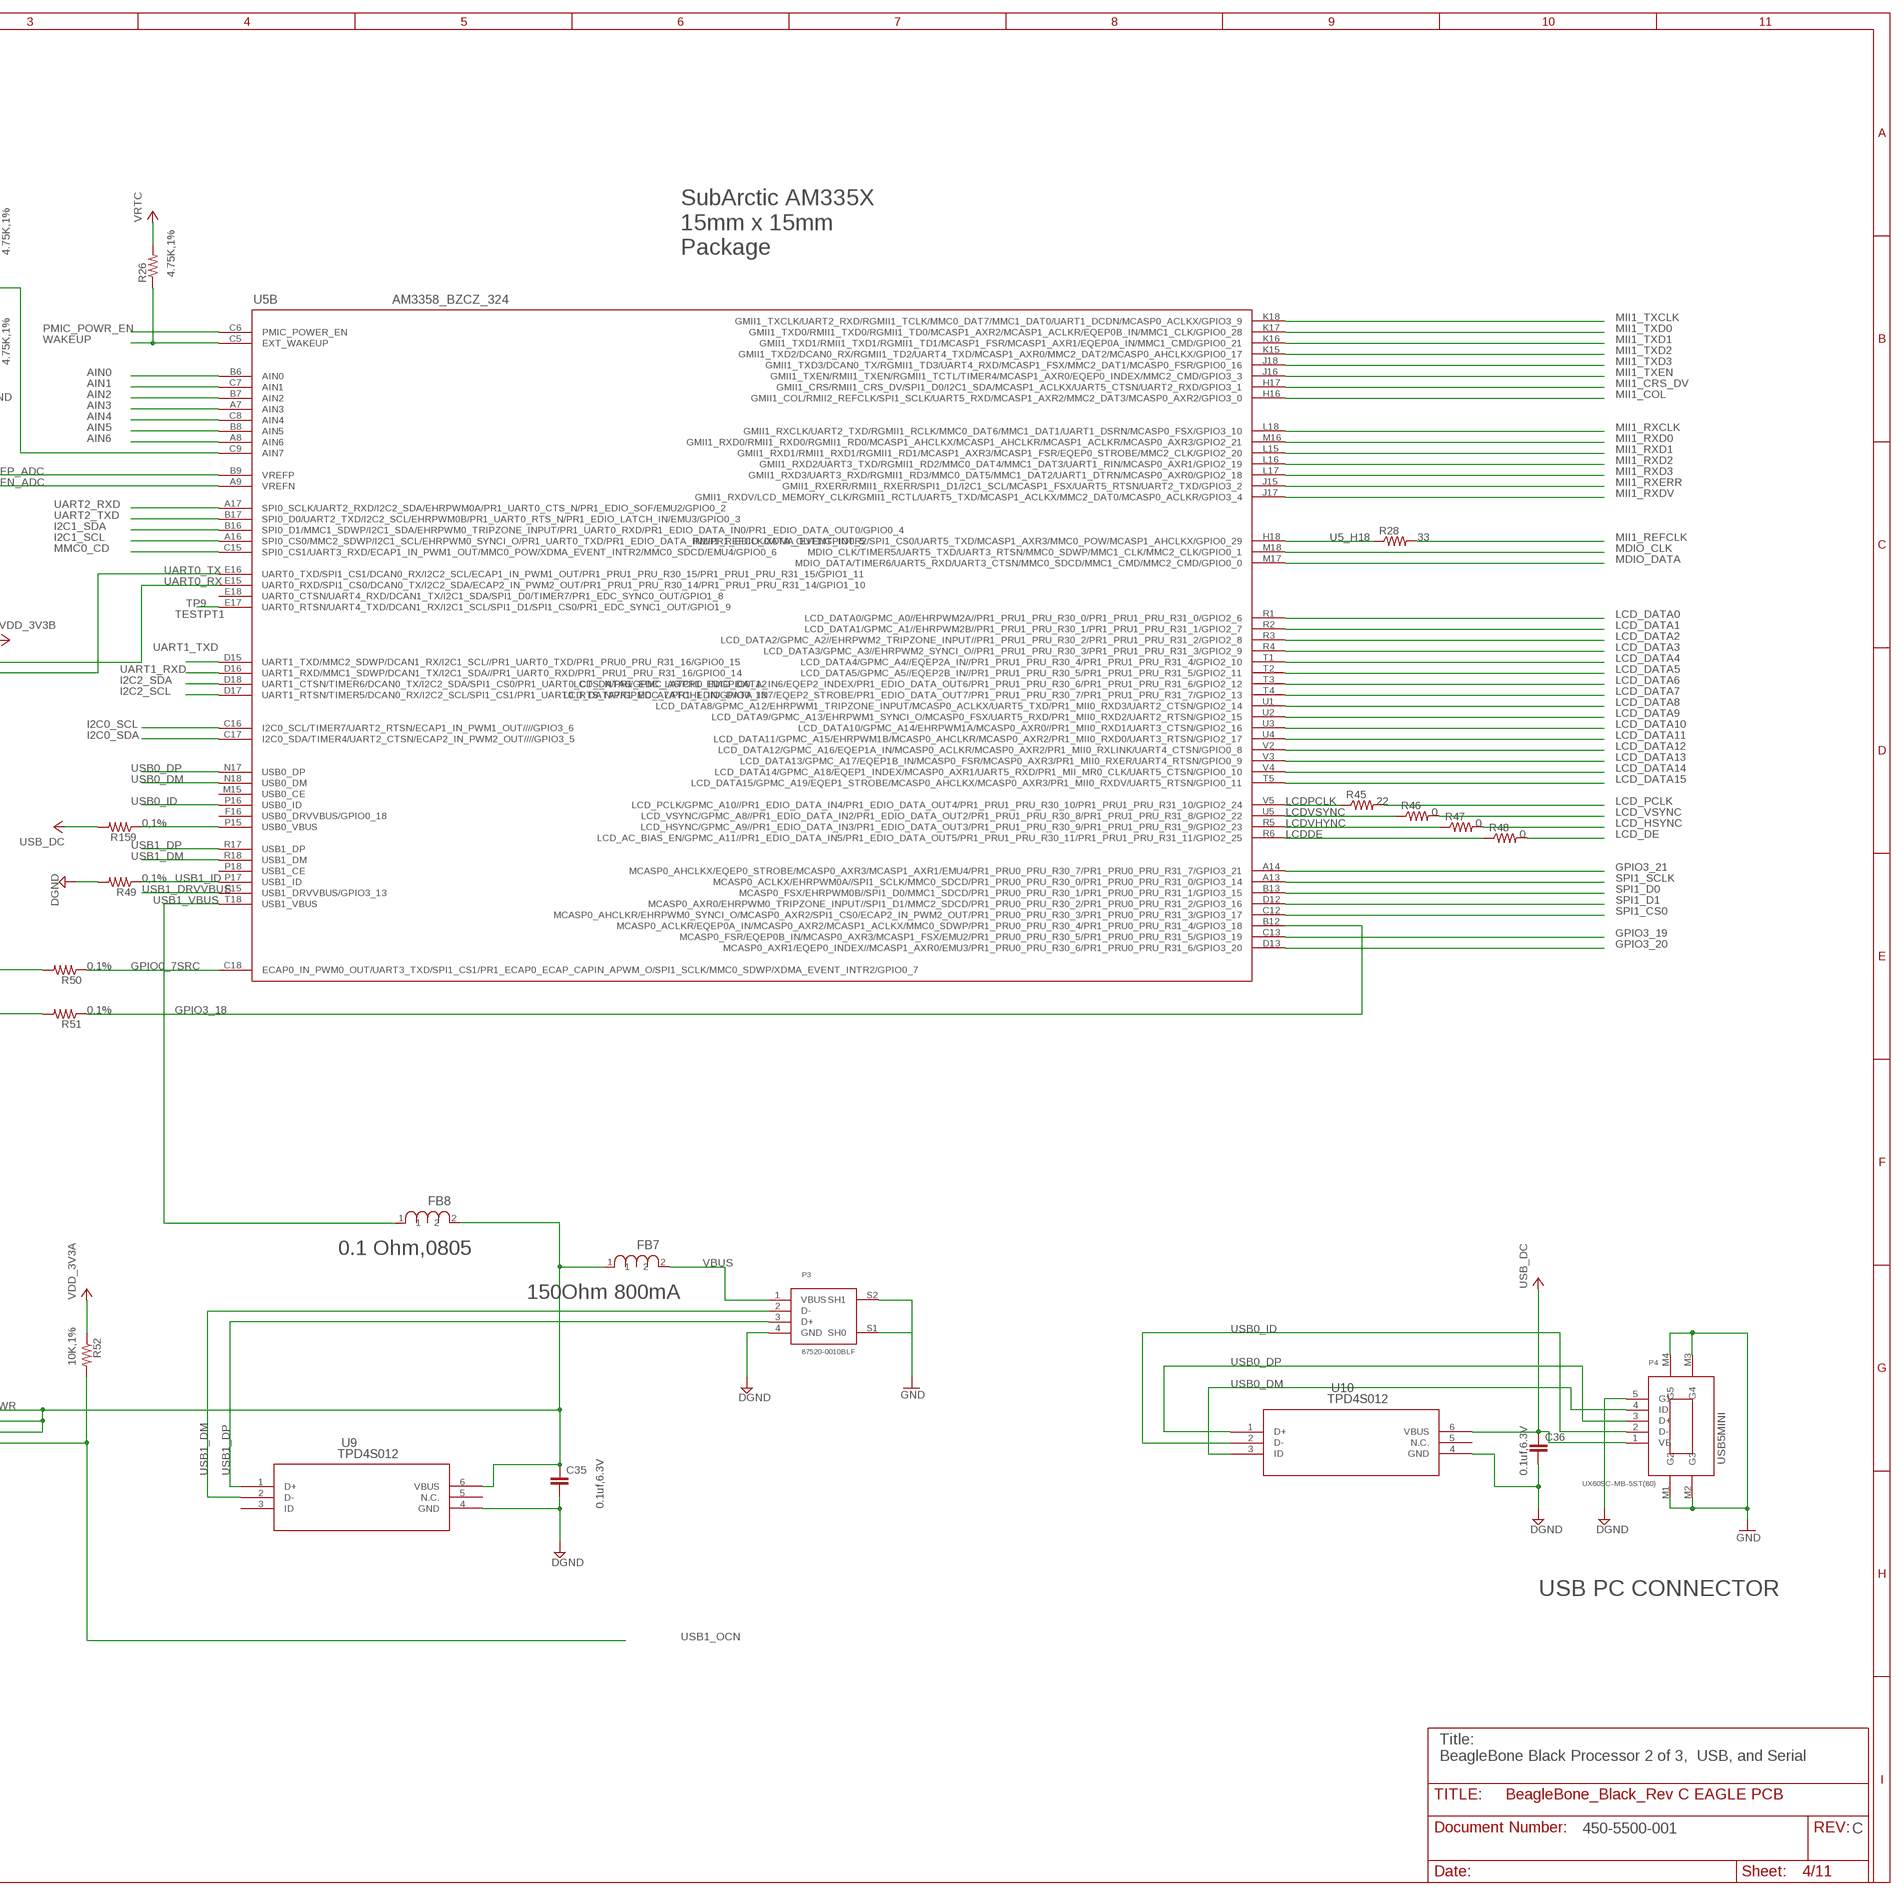
[diagram p5: schematic, sheet 4, part 2 of 2]

### Parts
C31  C-EUC0402  [C0402]
C32  C-EUC0402  [C0402]
C33  C-EUC0402  [C0402]
C34  AVE107M06D16T-F  [AVE107M06D16T-F]
C35  C-EUC0402  [C0402]
C36  C-EUC0402  [C0402]
C155  C-EUC0402  [C0402]
FB7  150Ohm 800mA  PM0805-R10K-RC  [INDC2115X15N]
FB8  0.1 Ohm,0805  PM0805-R10K-RC  [INDC2115X15N]
J1  68000-406HLF  [68000-406HLF]
P3  87520-0010BLF  [87520-0010BLF]
P4  UX60SC-MB-5ST(80)  [UX60SC-MB-5ST(80)]
R26  R-US_R0402  [R0402]
R27A  R-US_R0402  [R0402]
R28  R-US_R0402  [R0402]
R45  R-US_R0402  [R0402]
R46  R-US_R0402  [R0402]
R47  R-US_R0402  [R0402]
R48  R-US_R0402  [R0402]
R49  R-US_R0402  [R0402]
R50  R-US_R0402  [R0402]
R51  R-US_R0402  [R0402]
R52  R-US_R0402  [R0402]
R53  R-US_R0402  [R0402]
R159  R-US_R0402  [R0402]
R163  R-US_R0402  [R0402]
R164  R-US_R0402  [R0402]
R165  R-US_R0402  [R0402]
U8  TPS2051BD  TPS2051B_D_8  [D8]
U9  TPD4S012  TPD4S012_DRY_6  [DRY6]
U10  TPD4S012  TPD4S012_DRY_6  [DRY6]
U15  SN74LVC2G241DCU  SN74LVC2G241_DCU_8  [DCU8]

### Nets
AIN0: U5.B6(AIN0) ; also sheet 11
AIN1: U5.C7(AIN1) ; also sheet 11
AIN2: U5.B7(AIN2) ; also sheet 11
AIN3: U5.A7(AIN3) ; also sheet 11
AIN4: U5.C8(AIN4) ; also sheet 11
AIN5: U5.B8(AIN5) ; also sheet 11
AIN6: U5.A8(AIN6) ; also sheet 11
GND: C31.2 C32.2 C33.2 C34.- C35.2 C36.2 C155.1 J1.1 P3.4(GND) P3.S1(SH0) P3.S2(SH1) P4.5(G1) P4.M1(G2) P4.M2(G3) P4.M3(G4) P4.M4(G5) R49.2 R53.2 R164.1 R165.1 U5.A9(VREFN) U8.1(GND) U9.4(GND) U10.4(GND) U15.1(*1OE) U15.4(GND) ; supply symbol labelled DGND, GNDA_ADC ; also sheet 2,3,5,6,7,8,9,10,11
GPIO0_7: R50.2 R51.2 ; also sheet 11
GPIO3_19: U5.C13(MCASP0_FSR/EQEP0B_IN/MCASP0_AXR3/MCASP1_FSX/EMU2/PR1_PRU0_PRU_R30_5/PR1_PRU0_PRU_R31_5/GPIO3_19) ; also sheet 11
GPIO3_20: U5.D13(MCASP0_AXR1/EQEP0_INDEX//MCASP1_AXR0/EMU3/PR1_PRU0_PRU_R30_6/PR1_PRU0_PRU_R31_6/GPIO3_20) ; also sheet 3
GPIO3_21: U5.A14(MCASP0_AHCLKX/EQEP0_STROBE/MCASP0_AXR3/MCASP1_AXR1/EMU4/PR1_PRU0_PRU_R30_7/PR1_PRU0_PRU_R31_7/GPIO3_21) ; also sheet 3,11
I2C0_SCL: U5.C16(I2C0_SCL/TIMER7/UART2_RTSN/ECAP1_IN_PWM1_OUT////GPIO3_6) ; also sheet 2,10,11
I2C0_SDA: U5.C17(I2C0_SDA/TIMER4/UART2_CTSN/ECAP2_IN_PWM2_OUT////GPIO3_5) ; also sheet 2,10,11
I2C1_SCL: U5.A16(SPI0_CS0/MMC2_SDWP/I2C1_SCL/EHRPWM0_SYNCI_O/PR1_UART0_TXD/PR1_EDIO_DATA_IN1/PR1_EDIO_DATA_OUT1/GPIO0_5) ; also sheet 11
I2C1_SDA: U5.B16(SPI0_D1/MMC1_SDWP/I2C1_SDA/EHRPWM0_TRIPZONE_INPUT/PR1_UART0_RXD/PR1_EDIO_DATA_IN0/PR1_EDIO_DATA_OUT0/GPIO0_4) ; also sheet 11
I2C2_SCL: U5.D17(UART1_RTSN/TIMER5/DCAN0_RX/I2C2_SCL/SPI1_CS1/PR1_UART0_RTS_N/PR1_EDC_LATCH1_IN/GPIO0_13) ; also sheet 11
I2C2_SDA: U5.D18(UART1_CTSN/TIMER6/DCAN0_TX/I2C2_SDA/SPI1_CS0/PR1_UART0_CTS_N/PR1_EDC_LATCH0_IN/GPIO0_12) ; also sheet 11
LCD_DATA0: U5.R1(LCD_DATA0/GPMC_A0//EHRPWM2A//PR1_PRU1_PRU_R30_0/PR1_PRU1_PRU_R31_0/GPIO2_6) ; also sheet 6,10,11
LCD_DATA1: U5.R2(LCD_DATA1/GPMC_A1//EHRPWM2B//PR1_PRU1_PRU_R30_1/PR1_PRU1_PRU_R31_1/GPIO2_7) ; also sheet 6,10,11
LCD_DATA2: U5.R3(LCD_DATA2/GPMC_A2//EHRPWM2_TRIPZONE_INPUT//PR1_PRU1_PRU_R30_2/PR1_PRU1_PRU_R31_2/GPIO2_8) ; also sheet 6,10,11
LCD_DATA3: U5.R4(LCD_DATA3/GPMC_A3//EHRPWM2_SYNCI_O//PR1_PRU1_PRU_R30_3/PR1_PRU1_PRU_R31_3/GPIO2_9) ; also sheet 6,10,11
LCD_DATA4: U5.T1(LCD_DATA4/GPMC_A4//EQEP2A_IN//PR1_PRU1_PRU_R30_4/PR1_PRU1_PRU_R31_4/GPIO2_10) ; also sheet 6,10,11
LCD_DATA5: U5.T2(LCD_DATA5/GPMC_A5//EQEP2B_IN//PR1_PRU1_PRU_R30_5/PR1_PRU1_PRU_R31_5/GPIO2_11) ; also sheet 6,10,11
LCD_DATA6: U5.T3(LCD_DATA6/GPMC_A6/PR1_EDIO_DATA_IN6/EQEP2_INDEX/PR1_EDIO_DATA_OUT6/PR1_PRU1_PRU_R30_6/PR1_PRU1_PRU_R31_6/GPIO2_12) ; also sheet 6,10,11
LCD_DATA7: U5.T4(LCD_DATA7/GPMC_A7/PR1_EDIO_DATA_IN7/EQEP2_STROBE/PR1_EDIO_DATA_OUT7/PR1_PRU1_PRU_R30_7/PR1_PRU1_PRU_R31_7/GPIO2_13) ; also sheet 6,10,11
LCD_DATA8: U5.U1(LCD_DATA8/GPMC_A12/EHRPWM1_TRIPZONE_INPUT/MCASP0_ACLKX/UART5_TXD/PR1_MII0_RXD3/UART2_CTSN/GPIO2_14) ; also sheet 6,10,11
LCD_DATA9: U5.U2(LCD_DATA9/GPMC_A13/EHRPWM1_SYNCI_O/MCASP0_FSX/UART5_RXD/PR1_MII0_RXD2/UART2_RTSN/GPIO2_15) ; also sheet 6,10,11
LCD_DATA10: U5.U3(LCD_DATA10/GPMC_A14/EHRPWM1A/MCASP0_AXR0//PR1_MII0_RXD1/UART3_CTSN/GPIO2_16) ; also sheet 6,10,11
LCD_DATA11: U5.U4(LCD_DATA11/GPMC_A15/EHRPWM1B/MCASP0_AHCLKR/MCASP0_AXR2/PR1_MII0_RXD0/UART3_RTSN/GPIO2_17) ; also sheet 6,10,11
LCD_DATA12: U5.V2(LCD_DATA12/GPMC_A16/EQEP1A_IN/MCASP0_ACLKR/MCASP0_AXR2/PR1_MII0_RXLINK/UART4_CTSN/GPIO0_8) ; also sheet 6,10,11
LCD_DATA13: U5.V3(LCD_DATA13/GPMC_A17/EQEP1B_IN/MCASP0_FSR/MCASP0_AXR3/PR1_MII0_RXER/UART4_RTSN/GPIO0_9) ; also sheet 6,10,11
LCD_DATA14: U5.V4(LCD_DATA14/GPMC_A18/EQEP1_INDEX/MCASP0_AXR1/UART5_RXD/PR1_MII_MR0_CLK/UART5_CTSN/GPIO0_10) ; also sheet 6,10,11
LCD_DATA15: U5.T5(LCD_DATA15/GPMC_A19/EQEP1_STROBE/MCASP0_AHCLKX/MCASP0_AXR3/PR1_MII0_RXDV/UART5_RTSN/GPIO0_11) ; also sheet 6,10,11
LCD_DE: R48.2 ; also sheet 10,11
LCD_HSYNC: R47.2 ; also sheet 10,11
LCD_PCLK: R45.2 ; also sheet 10,11
LCD_VSYNC: R46.2 ; also sheet 10,11
MDIO_CLK: U5.M18(MDIO_CLK/TIMER5/UART5_TXD/UART3_RTSN/MMC0_SDWP/MMC1_CLK/MMC2_CLK/GPIO0_1) ; also sheet 9
MDIO_DATA: U5.M17(MDIO_DATA/TIMER6/UART5_RXD/UART3_CTSN/MMC0_SDCD/MMC1_CMD/MMC2_CMD/GPIO0_0) ; also sheet 9
MII1_COL: U5.H16(GMII1_COL/RMII2_REFCLK/SPI1_SCLK/UART5_RXD/MCASP1_AXR2/MMC2_DAT3/MCASP0_AXR2/GPIO3_0) ; also sheet 9
MII1_CRS_DV: U5.H17(GMII1_CRS/RMII1_CRS_DV/SPI1_D0/I2C1_SDA/MCASP1_ACLKX/UART5_CTSN/UART2_RXD/GPIO3_1) ; also sheet 9
MII1_REFCLK: R28.2 ; also sheet 9
MII1_RXCLK: U5.L18(GMII1_RXCLK/UART2_TXD/RGMII1_RCLK/MMC0_DAT6/MMC1_DAT1/UART1_DSRN/MCASP0_FSX/GPIO3_10) ; also sheet 9
MII1_RXD0: U5.M16(GMII1_RXD0/RMII1_RXD0/RGMII1_RD0/MCASP1_AHCLKX/MCASP1_AHCLKR/MCASP1_ACLKR/MCASP0_AXR3/GPIO2_21) ; also sheet 9
MII1_RXD1: U5.L15(GMII1_RXD1/RMII1_RXD1/RGMII1_RD1/MCASP1_AXR3/MCASP1_FSR/EQEP0_STROBE/MMC2_CLK/GPIO2_20) ; also sheet 9
MII1_RXD2: U5.L16(GMII1_RXD2/UART3_TXD/RGMII1_RD2/MMC0_DAT4/MMC1_DAT3/UART1_RIN/MCASP0_AXR1/GPIO2_19) ; also sheet 9
MII1_RXD3: U5.L17(GMII1_RXD3/UART3_RXD/RGMII1_RD3/MMC0_DAT5/MMC1_DAT2/UART1_DTRN/MCASP0_AXR0/GPIO2_18) ; also sheet 9
MII1_RXDV: U5.J17(GMII1_RXDV/LCD_MEMORY_CLK/RGMII1_RCTL/UART5_TXD/MCASP1_ACLKX/MMC2_DAT0/MCASP0_ACLKR/GPIO3_4) ; also sheet 9
MII1_RXERR: U5.J15(GMII1_RXERR/RMII1_RXERR/SPI1_D1/I2C1_SCL/MCASP1_FSX/UART5_RTSN/UART2_TXD/GPIO3_2) ; also sheet 9
MII1_TXCLK: U5.K18(GMII1_TXCLK/UART2_RXD/RGMII1_TCLK/MMC0_DAT7/MMC1_DAT0/UART1_DCDN/MCASP0_ACLKX/GPIO3_9) ; also sheet 9
MII1_TXD0: U5.K17(GMII1_TXD0/RMII1_TXD0/RGMII1_TD0/MCASP1_AXR2/MCASP1_ACLKR/EQEP0B_IN/MMC1_CLK/GPIO0_28) ; also sheet 9
MII1_TXD1: U5.K16(GMII1_TXD1/RMII1_TXD1/RGMII1_TD1/MCASP1_FSR/MCASP1_AXR1/EQEP0A_IN/MMC1_CMD/GPIO0_21) ; also sheet 9
MII1_TXD2: U5.K15(GMII1_TXD2/DCAN0_RX/RGMII1_TD2/UART4_TXD/MCASP1_AXR0/MMC2_DAT2/MCASP0_AHCLKX/GPIO0_17) ; also sheet 9
MII1_TXD3: U5.J18(GMII1_TXD3/DCAN0_TX/RGMII1_TD3/UART4_RXD/MCASP1_FSX/MMC2_DAT1/MCASP0_FSR/GPIO0_16) ; also sheet 9
MII1_TXEN: U5.J16(GMII1_TXEN/RMII1_TXEN/RGMII1_TCTL/TIMER4/MCASP1_AXR0/EQEP0_INDEX/MMC2_CMD/GPIO3_3) ; also sheet 9
MMC0_CD: U5.C15(SPI0_CS1/UART3_RXD/ECAP1_IN_PWM1_OUT/MMC0_POW/XDMA_EVENT_INTR2/MMC0_SDCD/EMU4/GPIO0_6) ; also sheet 3,11
N$174: R28.1 U5.H18(RMII1_REFCLK/XDMA_EVENT_INTR2/SPI1_CS0/UART5_TXD/MCASP1_AXR3/MMC0_POW/MCASP1_AHCLKX/GPIO0_29)
N$192: R45.1 U5.V5(LCD_PCLK/GPMC_A10//PR1_EDIO_DATA_IN4/PR1_EDIO_DATA_OUT4/PR1_PRU1_PRU_R30_10/PR1_PRU1_PRU_R31_10/GPIO2_24)
N$194: R46.1 U5.U5(LCD_VSYNC/GPMC_A8//PR1_EDIO_DATA_IN2/PR1_EDIO_DATA_OUT2/PR1_PRU1_PRU_R30_8/PR1_PRU1_PRU_R31_8/GPIO2_22)
N$196: R47.1 U5.R5(LCD_HSYNC/GPMC_A9//PR1_EDIO_DATA_IN3/PR1_EDIO_DATA_OUT3/PR1_PRU1_PRU_R30_9/PR1_PRU1_PRU_R31_9/GPIO2_23)
N$198: R48.1 U5.R6(LCD_AC_BIAS_EN/GPMC_A11//PR1_EDIO_DATA_IN5/PR1_EDIO_DATA_OUT5/PR1_PRU1_PRU_R30_11/PR1_PRU1_PRU_R31_11/GPIO2_25)
N$216: R163.1 R164.2 U5.C9(AIN7)
N$218: C31.1 C32.1 C33.1 R27A.1 U5.B9(VREFP)
N$223: R159.1 U5.P15(USB0_VBUS)
N$226: U5.E15(UART0_RXD/SPI1_CS0/DCAN0_TX/I2C2_SDA/ECAP2_IN_PWM2_OUT/PR1_PRU1_PRU_R30_14/PR1_PRU1_PRU_R31_14/GPIO1_10) U15.6(1Y)
N$227: U5.E16(UART0_TXD/SPI1_CS1/DCAN0_RX/I2C2_SCL/ECAP1_IN_PWM1_OUT/PR1_PRU1_PRU_R30_15/PR1_PRU1_PRU_R31_15/GPIO1_11) U15.5(2A)
N$228: U5.E17(UART0_RTSN/UART4_TXD/DCAN1_RX/I2C1_SCL/SPI1_D1/SPI1_CS0/PR1_EDC_SYNC1_OUT/GPIO1_9)
N$229: J1.4 R165.2 U15.2(1A)
N$230: J1.5 U15.3(2Y)
N$235: U5.N17(USB0_DP)
N$236: U5.N18(USB0_DM)
N$237: U5.R17(USB1_DP)
N$238: U5.P16(USB0_ID)
N$239: U5.R18(USB1_DM)
N$240: U5.F15(USB1_DRVVBUS/GPIO3_13)
N$241: R49.1 U5.P17(USB1_ID)
N$242: R50.1 U5.C18(ECAP0_IN_PWM0_OUT/UART3_TXD/SPI1_CS1/PR1_ECAP0_ECAP_CAPIN_APWM_O/SPI1_SCLK/MMC0_SDWP/XDMA_EVENT_INTR2/GPIO0_7)
N$244: R51.1 U5.B12(MCASP0_ACLKR/EQEP0A_IN/MCASP0_AXR2/MCASP1_ACLKX/MMC0_SDWP/PR1_PRU0_PRU_R30_4/PR1_PRU0_PRU_R31_4/GPIO3_18)
N$245: R53.1 U8.4(*EN)
N$246: FB7.2 P3.1(VBUS)
N$247: FB8.1 U5.T18(USB1_VBUS)
N$248: C35.1 FB7.1 FB8.2 U8.6(OUT_2) U8.7(OUT_3) U8.8(OUT) U9.6(VBUS)
N$249: P3.3(D+) U9.1(D+)
N$250: P3.2(D-) U9.2(D-)
N$255: P4.4(ID) U10.3(ID)
N$256: P4.3(D+) U10.1(D+)
N$257: P4.2(D-) U10.2(D-)
PMIC_POWR_EN: U5.C6(PMIC_POWER_EN) ; also sheet 2
SPI1_CS0: U5.C12(MCASP0_AHCLKR/EHRPWM0_SYNCI_O/MCASP0_AXR2/SPI1_CS0/ECAP2_IN_PWM2_OUT/PR1_PRU0_PRU_R30_3/PR1_PRU0_PRU_R31_3/GPIO3_17) ; also sheet 10,11
SPI1_D0: U5.B13(MCASP0_FSX/EHRPWM0B//SPI1_D0/MMC1_SDCD/PR1_PRU0_PRU_R30_1/PR1_PRU0_PRU_R31_1/GPIO3_15) ; also sheet 10,11
SPI1_D1: U5.D12(MCASP0_AXR0/EHRPWM0_TRIPZONE_INPUT//SPI1_D1/MMC2_SDCD/PR1_PRU0_PRU_R30_2/PR1_PRU0_PRU_R31_2/GPIO3_16) ; also sheet 11
SPI1_SCLK: U5.A13(MCASP0_ACLKX/EHRPWM0A//SPI1_SCLK/MMC0_SDCD/PR1_PRU0_PRU_R30_0/PR1_PRU0_PRU_R31_0/GPIO3_14) ; also sheet 10,11
UART1_RXD: U5.D16(UART1_RXD/MMC1_SDWP/DCAN1_TX/I2C1_SDA//PR1_UART0_RXD/PR1_PRU1_PRU_R31_16/GPIO0_14) ; also sheet 11
UART1_TXD: U5.D15(UART1_TXD/MMC2_SDWP/DCAN1_RX/I2C1_SCL//PR1_UART0_TXD/PR1_PRU0_PRU_R31_16/GPIO0_15) ; also sheet 11
UART2_RXD: U5.A17(SPI0_SCLK/UART2_RXD/I2C2_SDA/EHRPWM0A/PR1_UART0_CTS_N/PR1_EDIO_SOF/EMU2/GPIO0_2) ; also sheet 11
UART2_TXD: U5.B17(SPI0_D0/UART2_TXD/I2C2_SCL/EHRPWM0B/PR1_UART0_RTS_N/PR1_EDIO_LATCH_IN/EMU3/GPIO0_3) ; also sheet 11
USB1_OCN: R52.2 U8.5(*OC) ; also sheet 3
VCC: C34.+ C36.1 C155.2 P4.1(VB) R26.2 R27A.2 R52.1 R159.2 R163.2 U8.2(IN_2) U8.3(IN) U10.6(VBUS) U15.7(2OE) U15.8(VCC) ; supply symbol labelled VRTC, VDD_3V3B, VDD_ADC, USB_DC, SYS_5V, VDD_3V3A ; also sheet 2,3,5,6,7,8,9,10,11
WAKEUP: R26.1 U5.C5(EXT_WAKEUP) ; also sheet 2
Unconnected: J1.2 J1.3 J1.6 U5.E18(UART0_CTSN/UART4_RXD/DCAN1_TX/I2C1_SDA/SPI1_D0/TIMER7/PR1_EDC_SYNC0_OUT/GPIO1_8) U5.F16(USB0_DRVVBUS/GPIO0_18) U5.M15(USB0_CE) U5.P18(USB1_CE) U9.3(ID) U9.5(N.C.) U10.5(N.C.)

### Notes on the sheet
- 4.75K,1%
- SubArctic AM335X
  15mm x 15mm
  Package
- 4.75K,1%
- 4.75K,1%
- 0,1%
- 0.1uf,6.3V | VREFP_ADC
- VREFN_ADC
- 0.1uf,6.3V | 0.001uf,50V
- U5_H18 | 33
- UART0_TX
- Mark pin 1 clearly | UART0_RX
- 0.1uf,6.3V | TP9
- TESTPT1
- POWERDOWN ISOLATION
- 100K,1%
- UART0 Serial Port
  USB to TTL
  Serial Cable
  3.3V
- USB0_DP
- USB0_DM
- USB0_ID | LCDPCLK | 22
- LCDVSYNC | 0
- 0,1% | LCDVHYNC | 0
- LCDDE | 0
- USB1_DP
- USB1_DM
- 0,1% | USB1_ID
- USB1_DRVVBUS
- USB1_VBUS
- 0,1% | GPIO0_7SRC
- 0,1% | GPIO3_18
- VBUS
- USB0_ID
- 10K,1% | USB0_DP
- USB0_DM
- USB1_PWR
- USB1_DRVVBUS
- USB5MINI
- USB1_DM | USB1_DP | 0.1uf,6.3V
- 0.1uf,6.3V
- 10K,1%
- 100uF,6.3V
- USB PC CONNECTOR
- USB HOST
- Title: 
  BeagleBone Black Processor 2 of 3,  USB, and Serial
- 450-5500-001 | C

## Sheet 5 of 11
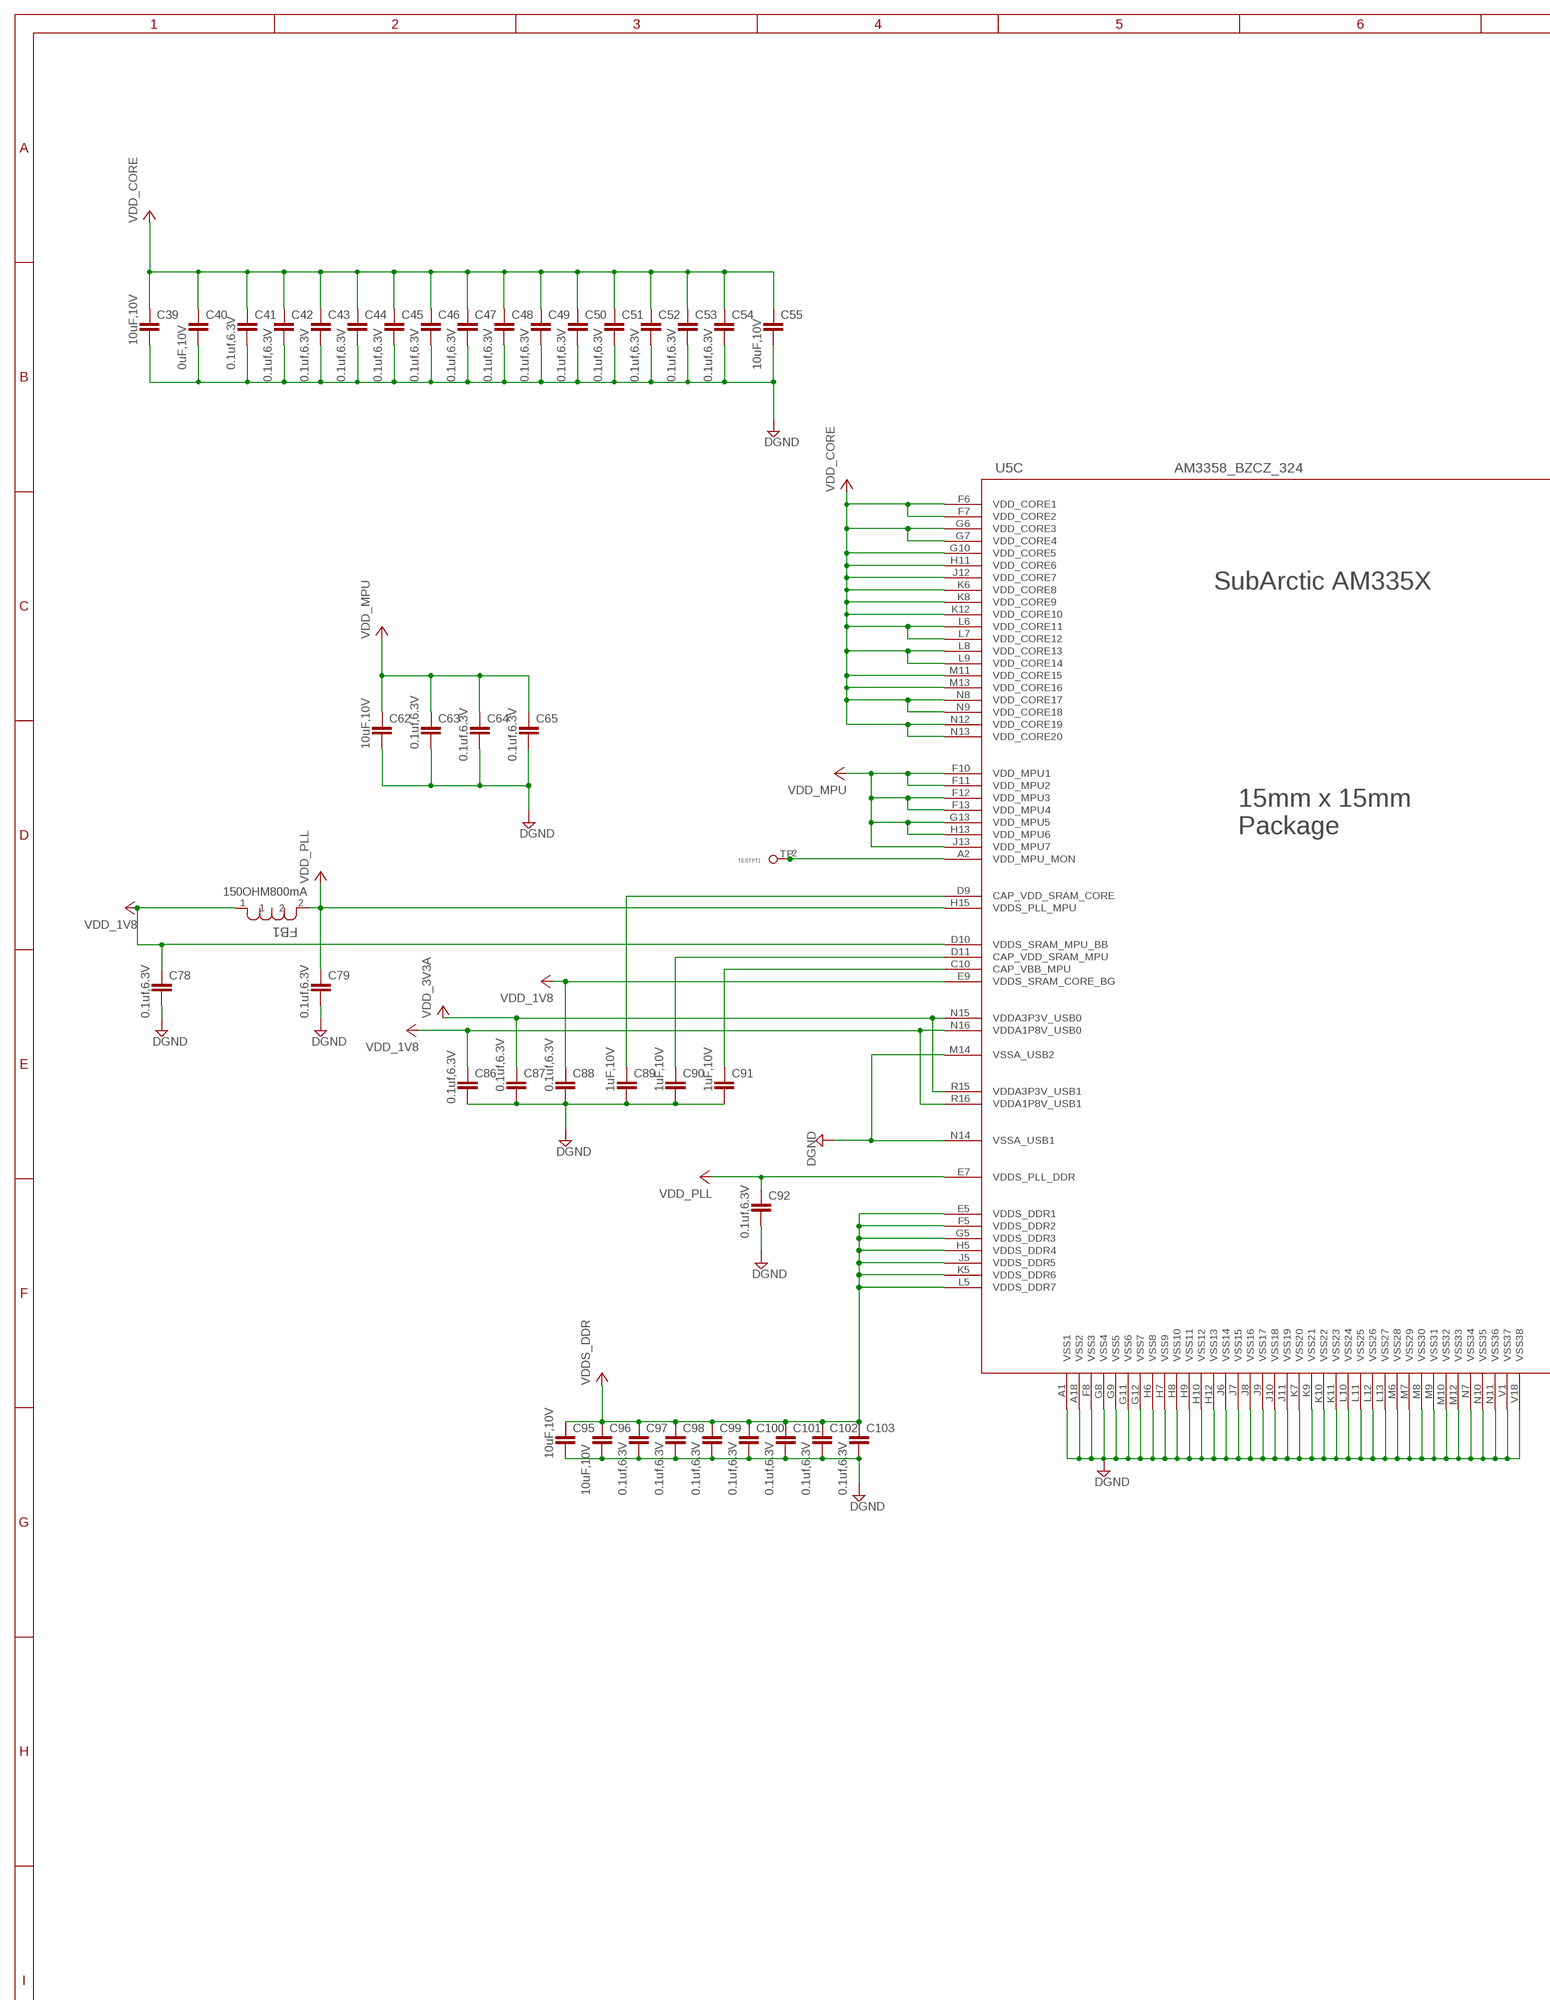
[diagram p6: schematic, sheet 5, part 1 of 2]
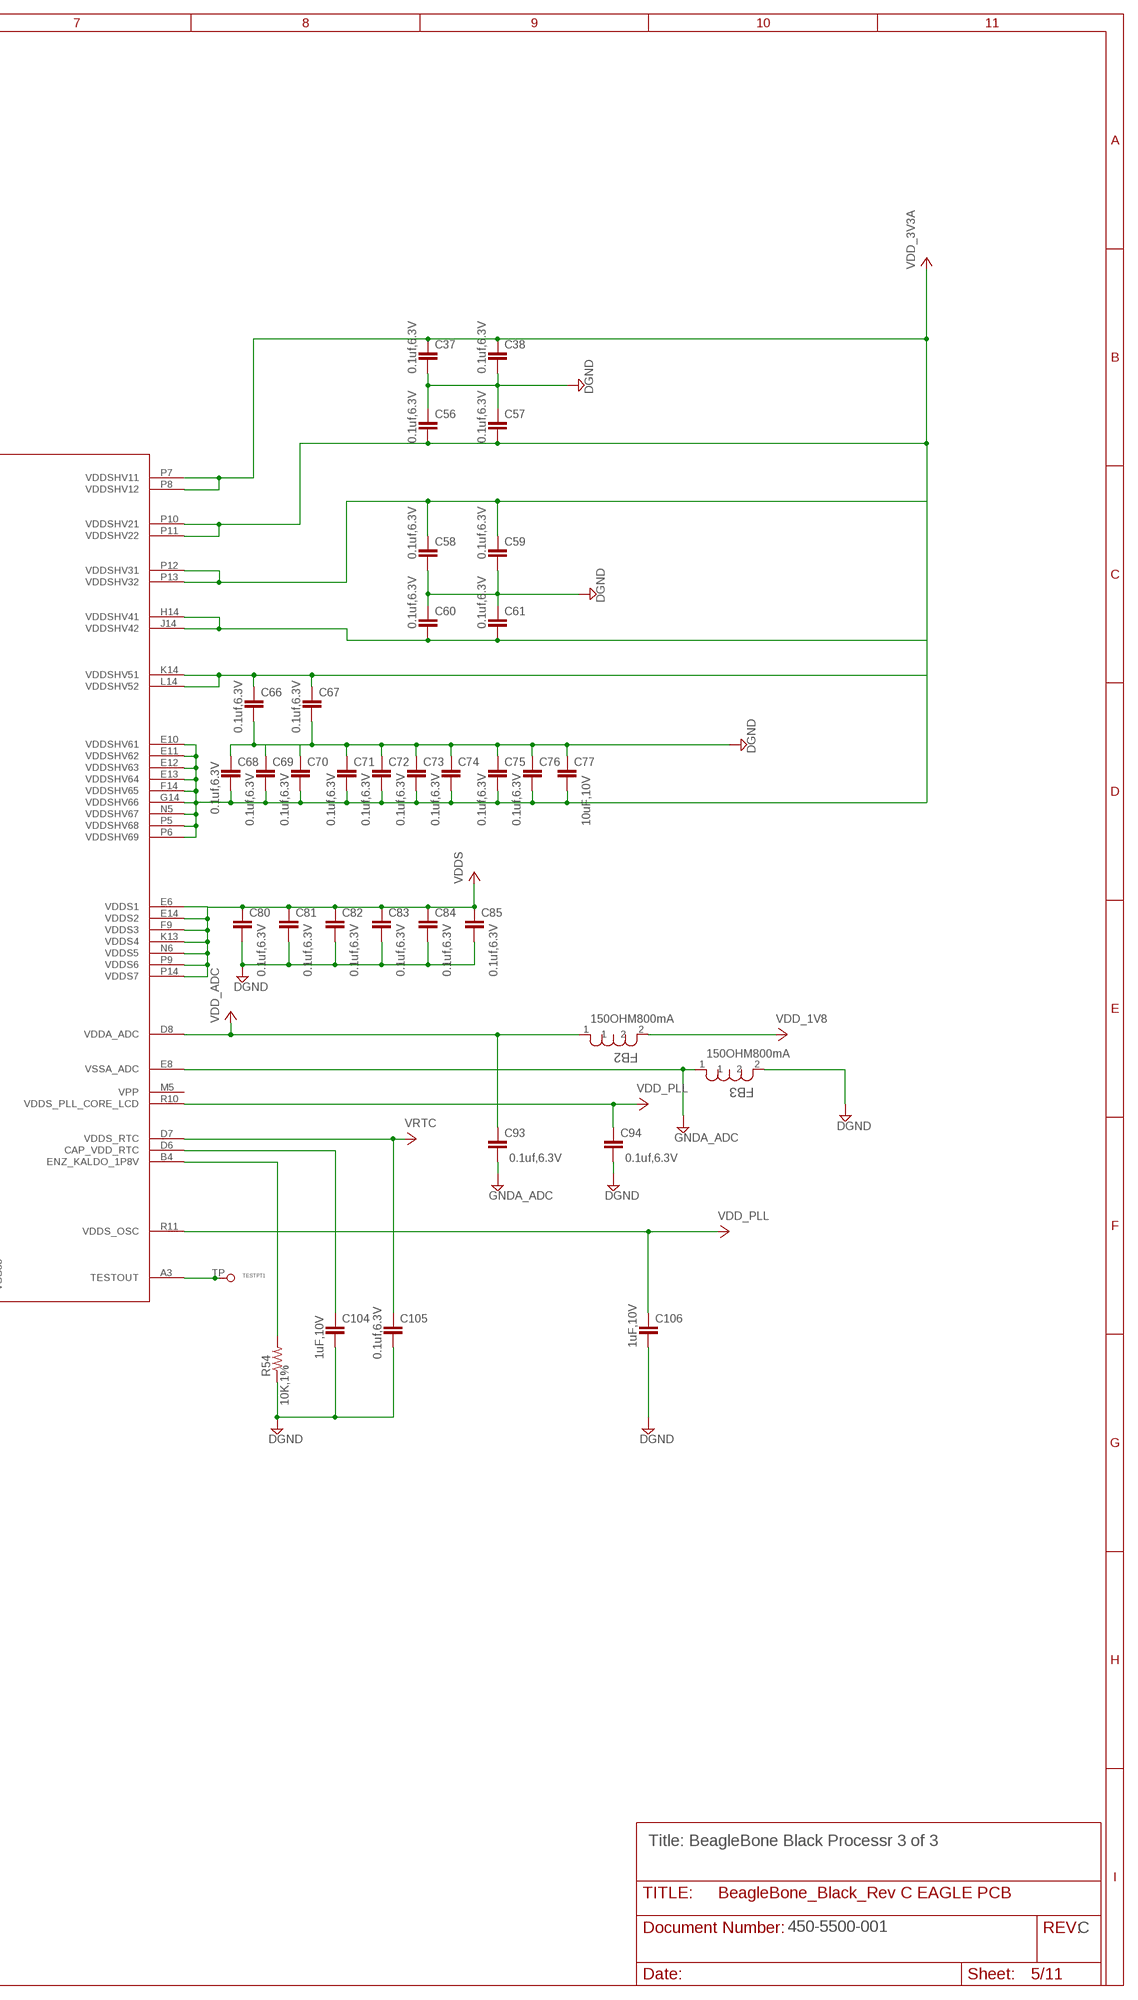
[diagram p7: schematic, sheet 5, part 2 of 2]

### Parts
C37  C-EUC0402  [C0402]
C38  C-EUC0402  [C0402]
C39  C-EUC0805  [C0805]
C40  C-EUC0805  [C0805]
C41  C-EUC0402  [C0402]
C42  C-EUC0402  [C0402]
C43  C-EUC0402  [C0402]
C44  C-EUC0402  [C0402]
C45  C-EUC0402  [C0402]
C46  C-EUC0402  [C0402]
C47  C-EUC0402  [C0402]
C48  C-EUC0402  [C0402]
C49  C-EUC0402  [C0402]
C50  C-EUC0402  [C0402]
C51  C-EUC0402  [C0402]
C52  C-EUC0402  [C0402]
C53  C-EUC0402  [C0402]
C54  C-EUC0402  [C0402]
C55  C-EUC0805  [C0805]
C56  C-EUC0402  [C0402]
C57  C-EUC0402  [C0402]
C58  C-EUC0402  [C0402]
C59  C-EUC0402  [C0402]
C60  C-EUC0402  [C0402]
C61  C-EUC0402  [C0402]
C62  C-EUC0805  [C0805]
C63  C-EUC0402  [C0402]
C64  C-EUC0402  [C0402]
C65  C-EUC0402  [C0402]
C66  C-EUC0402  [C0402]
C67  C-EUC0402  [C0402]
C68  C-EUC0402  [C0402]
C69  C-EUC0402  [C0402]
C70  C-EUC0402  [C0402]
C71  C-EUC0402  [C0402]
C72  C-EUC0402  [C0402]
C73  C-EUC0402  [C0402]
C74  C-EUC0402  [C0402]
C75  C-EUC0402  [C0402]
C76  C-EUC0402  [C0402]
C77  C-EUC0402  [C0402]
C78  C-EUC0402  [C0402]
C79  C-EUC0402  [C0402]
C80  C-EUC0402  [C0402]
C81  C-EUC0402  [C0402]
C82  C-EUC0402  [C0402]
C83  C-EUC0402  [C0402]
C84  C-EUC0402  [C0402]
C85  C-EUC0402  [C0402]
C86  C-EUC0402  [C0402]
C87  C-EUC0402  [C0402]
C88  C-EUC0402  [C0402]
C89  C-EUC0402  [C0402]
C90  C-EUC0402  [C0402]
C91  C-EUC0402  [C0402]
C92  C-EUC0402  [C0402]
C93  C-EUC0402  [C0402]
C94  C-EUC0402  [C0402]
C95  C-EUC0805  [C0805]
C96  C-EUC0805  [C0805]
C97  C-EUC0805  [C0805]
C98  C-EUC0805  [C0805]
C99  C-EUC0805  [C0805]
C100  C-EUC0805  [C0805]
C101  C-EUC0805  [C0805]
C102  C-EUC0805  [C0805]
C103  C-EUC0805  [C0805]
C104  C-EUC0402  [C0402]
C105  C-EUC0402  [C0402]
C106  C-EUC0402  [C0402]
FB1  PM0805-R10K-RC  [INDC2115X15N]
FB2  PM0805-R10K-RC  [INDC2115X15N]
FB3  PM0805-R10K-RC  [INDC2115X15N]
R54  R-US_R0402  [R0402]
TP2  TESTPOINT  [TESTPOINT]
TP3  TESTPOINT  [TESTPOINT]

### Nets
GND: C37.2 C38.2 C39.2 C40.2 C41.2 C42.2 C43.2 C44.2 C45.2 C46.2 C47.2 C48.2 C49.2 C50.2 C51.2 C52.2 C53.2 C54.2 C55.2 C56.1 C57.1 C58.2 C59.2 C60.1 C61.1 C62.2 C63.2 C64.2 C65.2 C66.2 C67.2 C68.1 C69.1 C70.1 C71.1 C72.1 C73.1 C74.1 C75.1 C76.1 C77.1 C78.2 C79.2 C80.2 C81.2 C82.2 C83.2 C84.2 C85.2 C86.2 C87.2 C88.2 C89.2 C90.2 C91.2 C92.2 C93.2 C94.2 C95.2 C96.2 C97.2 C98.2 C99.2 C100.2 C101.2 C102.2 C103.2 C104.2 C105.2 C106.2 FB3.1 R54.1 U5.A1(VSS1) U5.A18(VSS2) U5.E8(VSSA_ADC) U5.F8(VSS3) U5.G8(VSS4) U5.G9(VSS5) U5.G11(VSS6) U5.G12(VSS7) U5.H6(VSS8) U5.H7(VSS9) U5.H8(VSS10) U5.H9(VSS11) U5.H10(VSS12) U5.H12(VSS13) U5.J6(VSS14) U5.J7(VSS15) U5.J8(VSS16) U5.J9(VSS17) U5.J10(VSS18) U5.J11(VSS19) U5.K7(VSS20) U5.K9(VSS21) U5.K10(VSS22) U5.K11(VSS23) U5.L10(VSS24) U5.L11(VSS25) U5.L12(VSS26) U5.L13(VSS27) U5.M6(VSS28) U5.M7(VSS29) U5.M8(VSS30) U5.M9(VSS31) U5.M10(VSS32) U5.M12(VSS33) U5.M14(VSSA_USB2) U5.N7(VSS34) U5.N10(VSS35) U5.N11(VSS36) U5.N14(VSSA_USB1) U5.V1(VSS37) U5.V18(VSS38) ; supply symbol labelled DGND, GNDA_ADC ; also sheet 2,3,4,6,7,8,9,10,11
N$252: C39.1 C40.1 C41.1 C42.1 C43.1 C44.1 C45.1 C46.1 C47.1 C48.1 C49.1 C50.1 C51.1 C52.1 C53.1 C54.1 C55.1
N$253: C95.1 C96.1 C97.1 C98.1 C99.1 C100.1 C101.1 C102.1 C103.1 U5.E5(VDDS_DDR1) U5.F5(VDDS_DDR2) U5.G5(VDDS_DDR3) U5.H5(VDDS_DDR4) U5.J5(VDDS_DDR5) U5.K5(VDDS_DDR6) U5.L5(VDDS_DDR7)
N$254: TP3.TP U5.A3(TESTOUT)
N$258: C89.1 U5.D9(CAP_VDD_SRAM_CORE)
N$259: C90.1 U5.D11(CAP_VDD_SRAM_MPU)
N$260: C91.1 U5.C10(CAP_VBB_MPU)
N$262: TP2.TP U5.A2(VDD_MPU_MON)
N$264: FB3.2
N$265: C104.1 U5.D6(CAP_VDD_RTC)
N$266: C58.1 C59.1 U5.P12(VDDSHV31) U5.P13(VDDSHV32)
N$268: R54.2 U5.B4(ENZ_KALDO_1P8V)
VCC: C37.1 C38.1 C56.2 C57.2 C60.2 C61.2 C62.1 C63.1 C64.1 C65.1 C66.1 C67.1 C68.2 C69.2 C70.2 C71.2 C72.2 C73.2 C74.2 C75.2 C76.2 C77.2 C78.1 C79.1 C80.1 C81.1 C82.1 C83.1 C84.1 C85.1 C86.1 C87.1 C88.1 C92.1 C93.1 C94.1 C105.1 C106.1 FB1.1 FB1.2 FB2.1 FB2.2 U5.D7(VDDS_RTC) U5.D8(VDDA_ADC) U5.D10(VDDS_SRAM_MPU_BB) U5.E6(VDDS1) U5.E7(VDDS_PLL_DDR) U5.E9(VDDS_SRAM_CORE_BG) U5.E10(VDDSHV61) U5.E11(VDDSHV62) U5.E12(VDDSHV63) U5.E13(VDDSHV64) U5.E14(VDDS2) U5.F6(VDD_CORE1) U5.F7(VDD_CORE2) U5.F9(VDDS3) U5.F10(VDD_MPU1) U5.F11(VDD_MPU2) U5.F12(VDD_MPU3) U5.F13(VDD_MPU4) U5.F14(VDDSHV65) U5.G6(VDD_CORE3) U5.G7(VDD_CORE4) U5.G10(VDD_CORE5) U5.G13(VDD_MPU5) U5.G14(VDDSHV66) U5.H11(VDD_CORE6) U5.H13(VDD_MPU6) U5.H14(VDDSHV41) U5.H15(VDDS_PLL_MPU) U5.J12(VDD_CORE7) U5.J13(VDD_MPU7) U5.J14(VDDSHV42) U5.K6(VDD_CORE8) U5.K8(VDD_CORE9) U5.K12(VDD_CORE10) U5.K13(VDDS4) U5.K14(VDDSHV51) U5.L6(VDD_CORE11) U5.L7(VDD_CORE12) U5.L8(VDD_CORE13) U5.L9(VDD_CORE14) U5.L14(VDDSHV52) U5.M11(VDD_CORE15) U5.M13(VDD_CORE16) U5.N5(VDDSHV67) U5.N6(VDDS5) U5.N8(VDD_CORE17) U5.N9(VDD_CORE18) U5.N12(VDD_CORE19) U5.N13(VDD_CORE20) U5.N15(VDDA3P3V_USB0) U5.N16(VDDA1P8V_USB0) U5.P5(VDDSHV68) U5.P6(VDDSHV69) U5.P7(VDDSHV11) U5.P8(VDDSHV12) U5.P9(VDDS6) U5.P10(VDDSHV21) U5.P11(VDDSHV22) U5.P14(VDDS7) U5.R10(VDDS_PLL_CORE_LCD) U5.R11(VDDS_OSC) U5.R15(VDDA3P3V_USB1) U5.R16(VDDA1P8V_USB1) ; supply symbol labelled VDD_PLL, VDD_1V8, VDD_3V3A, VDD_MPU, VDD_CORE, VDDS_DDR, VDDS, VDD_ADC, VRTC ; also sheet 2,3,4,6,7,8,9,10,11
Unconnected: U5.M5(VPP)

### Notes on the sheet
- 10uF,10V
- 0uF,10V | 0.1uf,6.3V | 10uF,10V
- 0.1uf,6.3V | 0.1uf,6.3V | 0.1uf,6.3V | 0.1uf,6.3V | 0.1uf,6.3V | 0.1uf,6.3V | 0.1uf,6.3V | 0.1uf,6.3V | 0.1uf,6.3V | 0.1uf,6.3V | 0.1uf,6.3V | 0.1uf,6.3V | 0.1uf,6.3V
- 0.1uf,6.3V | 0.1uf,6.3V
- 0.1uf,6.3V | 0.1uf,6.3V
- SubArctic AM335X | 0.1uf,6.3V | 0.1uf,6.3V
- 0.1uf,6.3V | 0.1uf,6.3V
- 10uF,10V | 0.1uf,6.3V
- 0.1uf,6.3V | 0.1uf,6.3V
- 0.1uf,6.3V | 0.1uf,6.3V
- 15mm x 15mm
  Package
- 2 | 0.1uf,6.3V
- 0.1uf,6.3V | 0.1uf,6.3V | 0.1uf,6.3V | 0.1uf,6.3V | 0.1uf,6.3V | 0.1uf,6.3V | 0.1uf,6.3V | 0.1uf,6.3V | 10uF,10V
- 150OHM800mA
- 0.1uf,6.3V | 0.1uf,6.3V
- 0.1uf,6.3V | 0.1uf,6.3V | 0.1uf,6.3V | 0.1uf,6.3V | 0.1uf,6.3V | 0.1uf,6.3V
- 150OHM800mA
- 0.1uf,6.3V | 0.1uf,6.3V | 1uF,10V | 1uF,10V | 1uF,10V
- 0.1uf,6.3V
- 150OHM800mA
- 0.1uf,6.3V | 0.1uf,6.3V
- 0.1uf,6.3V
- 1uF,10V
- 1uF,10V | 0.1uf,6.3V
- 10uF,10V
- 10K,1%
- 10uF,10V | 0.1uf,6.3V | 0.1uf,6.3V | 0.1uf,6.3V | 0.1uf,6.3V | 0.1uf,6.3V | 0.1uf,6.3V | 0.1uf,6.3V
- Title: BeagleBone Black Processr 3 of 3
- 450-5500-001 | C

## Sheet 6 of 11
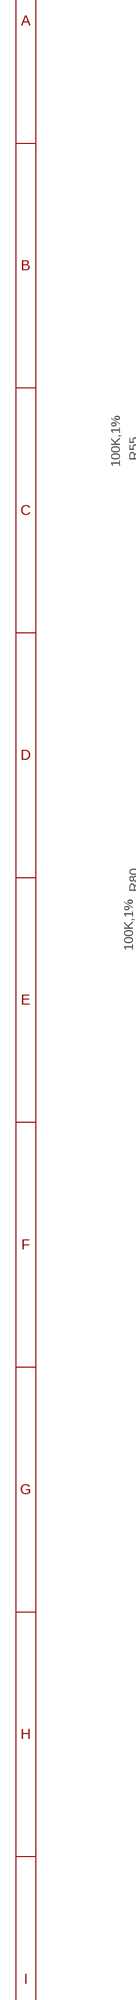
[diagram p8: schematic, sheet 6, part 1 of 2]
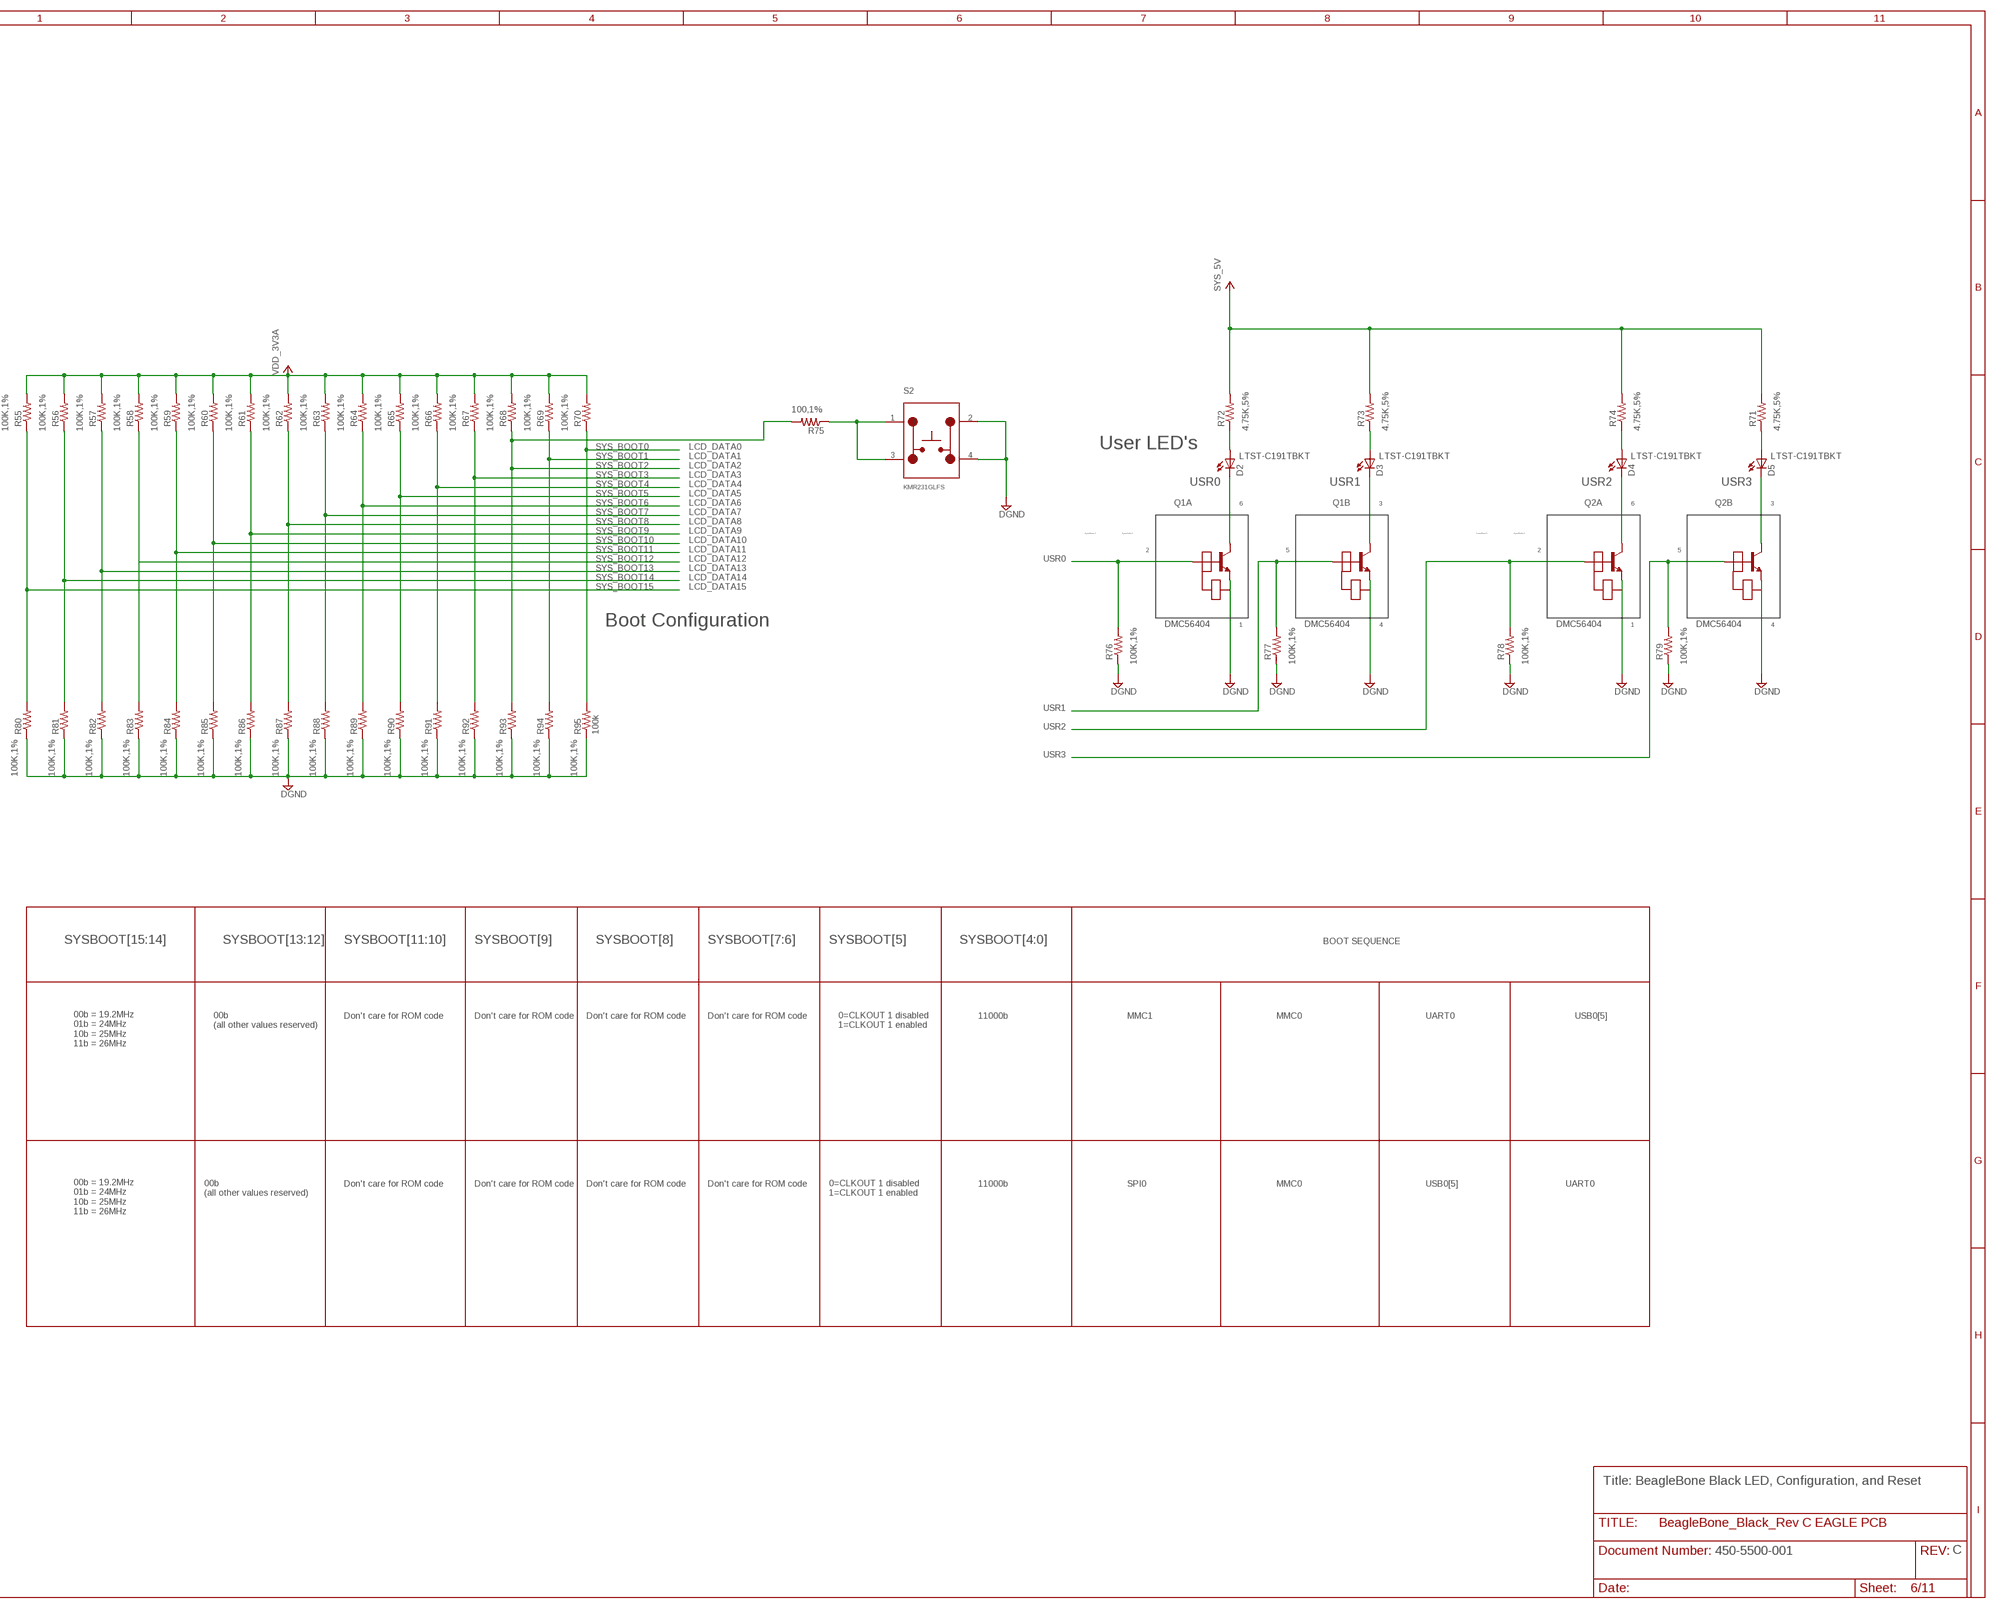
[diagram p9: schematic, sheet 6, part 2 of 2]

### Parts
D2  LEDCHIPLED_0603  [CHIPLED_0603]
D3  LEDCHIPLED_0603  [CHIPLED_0603]
D4  LEDCHIPLED_0603  [CHIPLED_0603]
D5  LEDCHIPLED_0603  [CHIPLED_0603]
R55  R-US_R0402  [R0402]
R56  R-US_R0402  [R0402]
R57  R-US_R0402  [R0402]
R58  R-US_R0402  [R0402]
R59  R-US_R0402  [R0402]
R60  R-US_R0402  [R0402]
R61  R-US_R0402  [R0402]
R62  R-US_R0402  [R0402]
R63  R-US_R0402  [R0402]
R64  R-US_R0402  [R0402]
R65  R-US_R0402  [R0402]
R66  R-US_R0402  [R0402]
R67  R-US_R0402  [R0402]
R68  R-US_R0402  [R0402]
R69  R-US_R0402  [R0402]
R70  R-US_R0402  [R0402]
R71  R-US_R0402  [R0402]
R72  R-US_R0402  [R0402]
R73  R-US_R0402  [R0402]
R74  R-US_R0402  [R0402]
R75  R-US_R0402  [R0402]
R76  R-US_R0402  [R0402]
R77  R-US_R0402  [R0402]
R78  R-US_R0402  [R0402]
R79  R-US_R0402  [R0402]
R80  R-US_R0402  [R0402]
R81  R-US_R0402  [R0402]
R82  R-US_R0402  [R0402]
R83  R-US_R0402  [R0402]
R84  R-US_R0402  [R0402]
R85  R-US_R0402  [R0402]
R86  R-US_R0402  [R0402]
R87  R-US_R0402  [R0402]
R88  R-US_R0402  [R0402]
R89  R-US_R0402  [R0402]
R90  R-US_R0402  [R0402]
R91  R-US_R0402  [R0402]
R92  R-US_R0402  [R0402]
R93  R-US_R0402  [R0402]
R94  R-US_R0402  [R0402]
R95  100k  R-US_R0402  [R0402]
S2  KMR231GLFS  [KMR231GLFS]
U$4  DMC564040R  [DMC564040R]
U$5  DMC564040R  [DMC564040R]

### Nets
GND: R76.1 R77.1 R78.1 R79.1 R80.1 R81.1 R82.1 R83.1 R84.1 R85.1 R86.1 R87.1 R88.1 R89.1 R90.1 R91.1 R92.1 R93.1 R94.1 R95.1 S2.2 S2.4 U$4.1 U$4.4 U$5.1 U$5.4 ; supply symbol labelled DGND ; also sheet 2,3,4,5,7,8,9,10,11
LCD_DATA0: R70.1 R95.2 ; also sheet 4,10,11
LCD_DATA1: R69.1 R94.2 ; also sheet 4,10,11
LCD_DATA2: R68.1 R75.2 R93.2 ; also sheet 4,10,11
LCD_DATA3: R67.1 R92.2 ; also sheet 4,10,11
LCD_DATA4: R66.1 R91.2 ; also sheet 4,10,11
LCD_DATA5: R65.1 R90.2 ; also sheet 4,10,11
LCD_DATA6: R64.1 R89.2 ; also sheet 4,10,11
LCD_DATA7: R63.1 R88.2 ; also sheet 4,10,11
LCD_DATA8: R62.1 R87.2 ; also sheet 4,10,11
LCD_DATA9: R61.1 R86.2 ; also sheet 4,10,11
LCD_DATA10: R60.1 R85.2 ; also sheet 4,10,11
LCD_DATA11: R59.1 R84.2 ; also sheet 4,10,11
LCD_DATA12: R58.1 R83.2 ; also sheet 4,10,11
LCD_DATA13: R57.1 R82.2 ; also sheet 4,10,11
LCD_DATA14: R56.1 R81.2 ; also sheet 4,10,11
LCD_DATA15: R55.1 R80.2 ; also sheet 4,10,11
N$269: D2.C U$4.6
N$270: D3.C U$4.3
N$271: D2.A R72.1
N$272: D3.A R73.1
N$277: D4.C U$5.6
N$278: D5.C U$5.3
N$279: D4.A R74.1
N$280: D5.A R71.1
N$295: R75.1 S2.1 S2.3
USR0: R76.2 U$4.2 ; also sheet 3
USR1: R77.2 U$4.5 ; also sheet 3
USR2: R78.2 U$5.2 ; also sheet 3
USR3: R79.2 U$5.5 ; also sheet 3
VCC: R55.2 R56.2 R57.2 R58.2 R59.2 R60.2 R61.2 R62.2 R63.2 R64.2 R65.2 R66.2 R67.2 R68.2 R69.2 R70.2 R71.2 R72.2 R73.2 R74.2 ; supply symbol labelled SYS_5V, VDD_3V3A ; also sheet 2,3,4,5,7,8,9,10,11

### Notes on the sheet
- S2
- 100,1%
- 100K,1% | 100K,1% | 100K,1% | 100K,1% | 100K,1% | 100K,1% | 100K,1% | 100K,1% | 100K,1% | 100K,1% | 100K,1% | 100K,1% | 100K,1% | 100K,1% | 100K,1% | 100K,1% | 4.75K,5% | 4.75K,5% | 4.75K,5% | 4.75K,5%
- SYS_BOOT0 | User LED's
- SYS_BOOT1 | LTST-C191TBKT | LTST-C191TBKT | LTST-C191TBKT | LTST-C191TBKT
- SYS_BOOT2
- SYS_BOOT3 | USR0 | USR1 | USR2 | USR3
- SYS_BOOT4
- SYS_BOOT5
- SYS_BOOT6 | Q1A | Q1B | Q2A | Q2B
- SYS_BOOT7
- SYS_BOOT8
- SYS_BOOT9
- SYS_BOOT10
- SYS_BOOT11
- SYS_BOOT12
- SYS_BOOT13
- SYS_BOOT14
- SYS_BOOT15
- Boot Configuration
- 100K,1% | 100K,1% | 100K,1% | 100K,1%
- 100K,1% | 100K,1% | 100K,1% | 100K,1% | 100K,1% | 100K,1% | 100K,1% | 100K,1% | 100K,1% | 100K,1% | 100K,1% | 100K,1% | 100K,1% | 100K,1% | 100K,1% | 100K,1%
- SYSBOOT[15:14] | SYSBOOT[13:12] | SYSBOOT[11:10] | SYSBOOT[9] | SYSBOOT[8] | SYSBOOT[7:6] | SYSBOOT[5] | SYSBOOT[4:0] | BOOT SEQUENCE
- Don't care for ROM code | Don't care for ROM code | Don't care for ROM code | Don't care for ROM code | 11000b | MMC1 | MMC0 | UART0 | USB0[5]
- 00b
  (all other values reserved)
- 0=CLKOUT 1 disabled 
  1=CLKOUT 1 enabled
- 00b = 19.2MHz
  01b = 24MHz
  10b = 25MHz
  11b = 26MHz
- Don't care for ROM code | Don't care for ROM code | Don't care for ROM code | Don't care for ROM code | 11000b | SPI0 | MMC0 | USB0[5] | UART0
- 00b
  (all other values reserved)
- 0=CLKOUT 1 disabled 
  1=CLKOUT 1 enabled
- 00b = 19.2MHz
  01b = 24MHz
  10b = 25MHz
  11b = 26MHz
- Title: BeagleBone Black LED, Configuration, and Reset
- 450-5500-001 | C

## Sheet 7 of 11
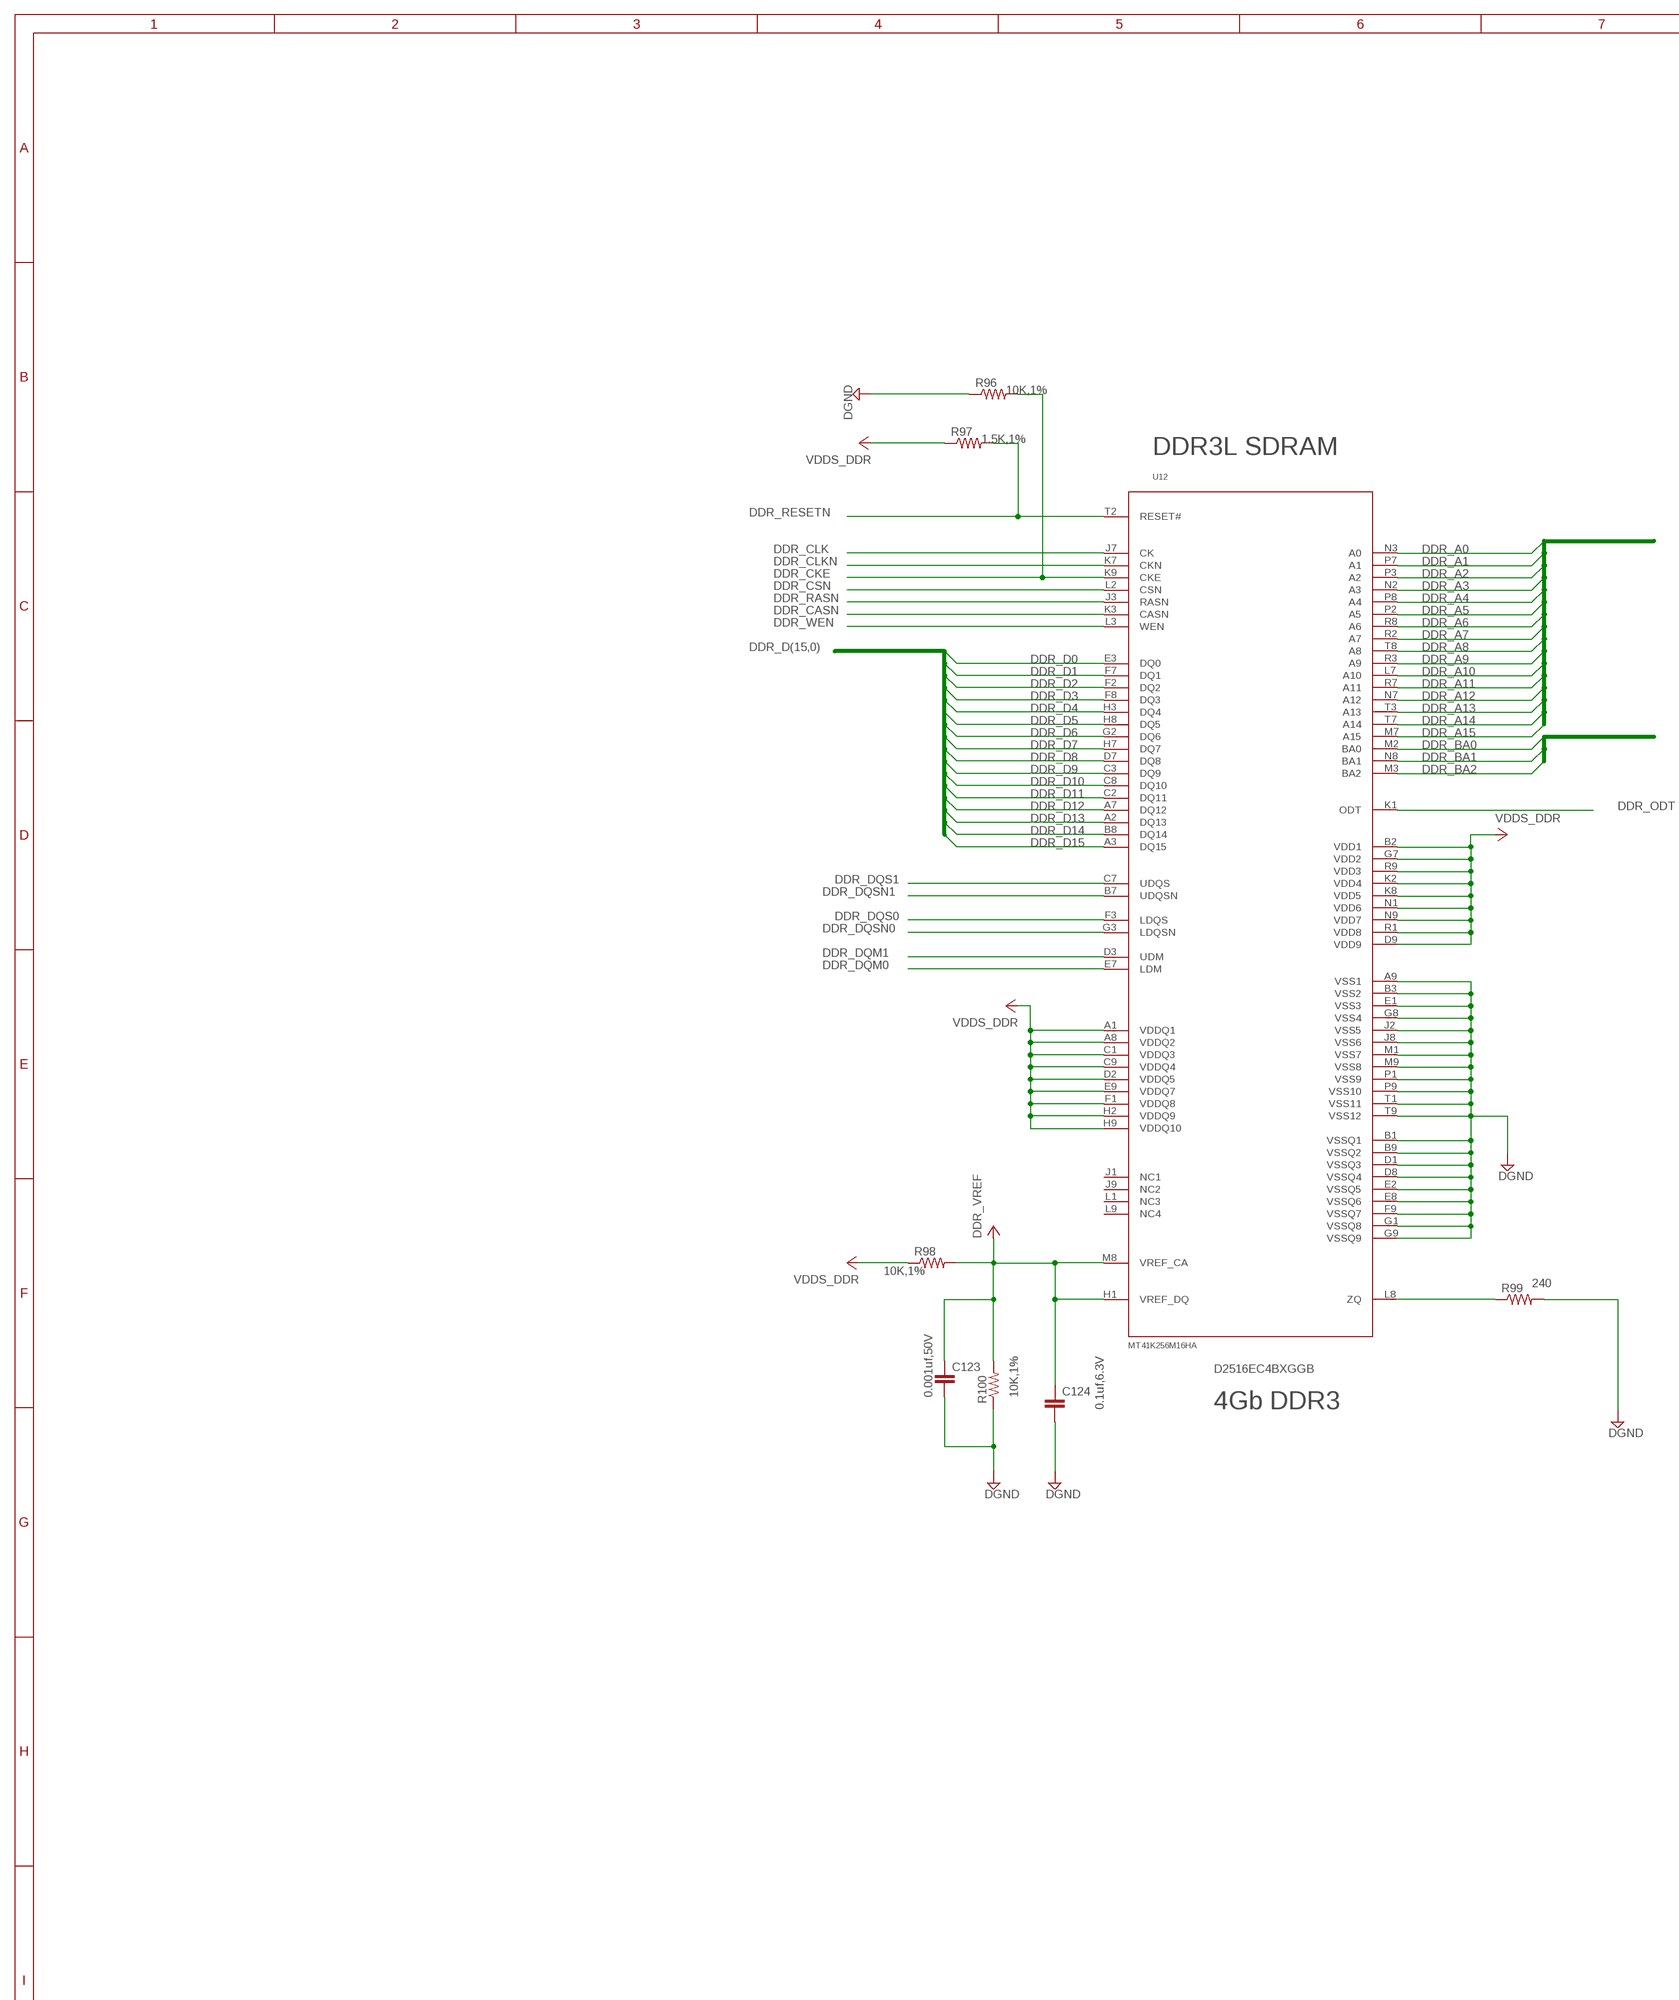
[diagram p10: schematic, sheet 7, part 1 of 2]
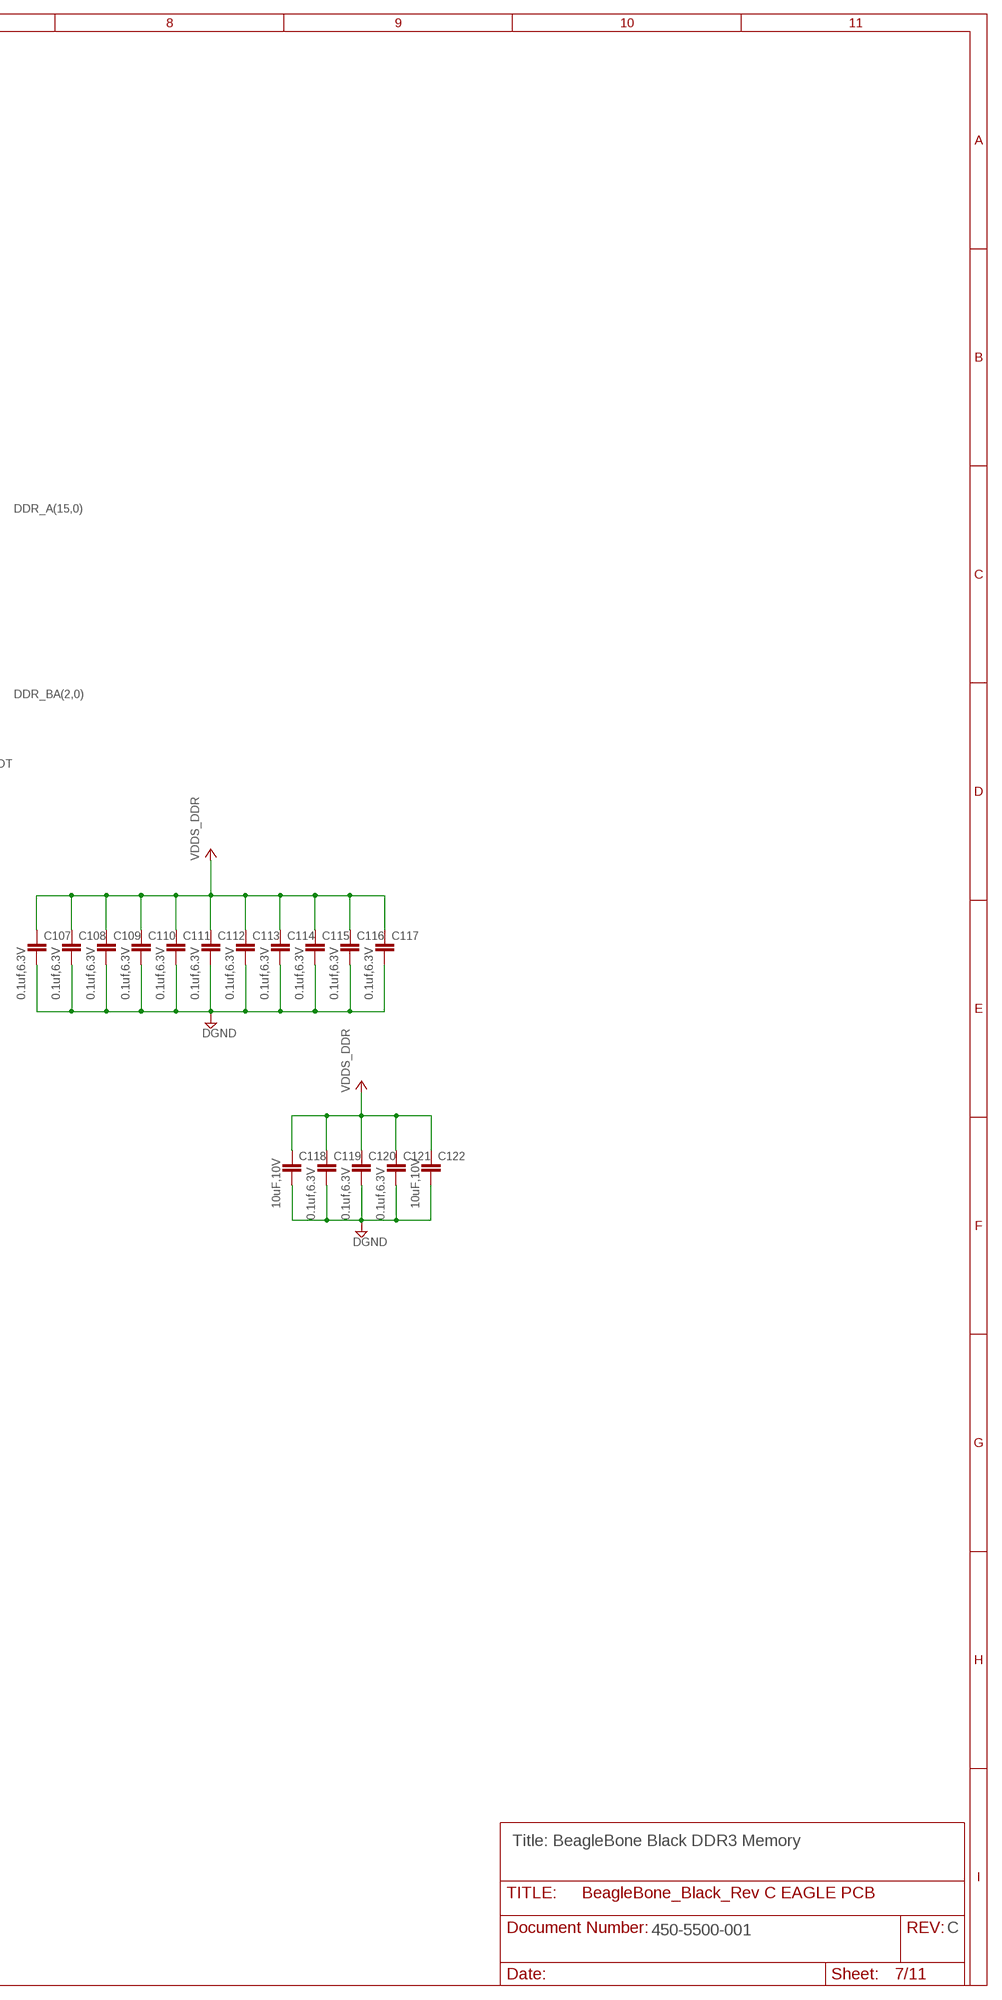
[diagram p11: schematic, sheet 7, part 2 of 2]

### Parts
C107  C-EUC0402  [C0402]
C108  C-EUC0402  [C0402]
C109  C-EUC0402  [C0402]
C110  C-EUC0402  [C0402]
C111  C-EUC0402  [C0402]
C112  C-EUC0402  [C0402]
C113  C-EUC0402  [C0402]
C114  C-EUC0402  [C0402]
C115  C-EUC0402  [C0402]
C116  C-EUC0402  [C0402]
C117  C-EUC0402  [C0402]
C118  C-EUC0805  [C0805]
C119  C-EUC0402  [C0402]
C120  C-EUC0402  [C0402]
C121  C-EUC0402  [C0402]
C122  C-EUC0402  [C0402]
C123  C-EUC0402  [C0402]
C124  C-EUC0402  [C0402]
R96  R-US_R0402  [R0402]
R97  R-US_R0402  [R0402]
R98  R-US_R0402  [R0402]
R99  R-US_R0402  [R0402]
R100  R-US_R0402  [R0402]
U12  MT41K256M16HA  [MT41K256M16HA]

### Nets
DDR_A(15,0): U12.L7(A10) U12.M7(A15) U12.N2(A3) U12.N3(A0) U12.N7(A12) U12.P2(A5) U12.P3(A2) U12.P7(A1) U12.P8(A4) U12.R2(A7) U12.R3(A9) U12.R7(A11) U12.R8(A6) U12.T3(A13) U12.T7(A14) U12.T8(A8) ; also sheet 3
DDR_BA(2,0): U12.M2(BA0) U12.M3(BA2) U12.N8(BA1) ; also sheet 3
DDR_CASN: U12.K3(CASN) ; also sheet 3
DDR_CKE: R96.2 U12.K9(CKE) ; also sheet 3
DDR_CLK: U12.J7(CK) ; also sheet 3
DDR_CLKN: U12.K7(CKN) ; also sheet 3
DDR_CSN: U12.L2(CSN) ; also sheet 3
DDR_D(15,0): U12.A2(DQ13) U12.A3(DQ15) U12.A7(DQ12) U12.B8(DQ14) U12.C2(DQ11) U12.C3(DQ9) U12.C8(DQ10) U12.D7(DQ8) U12.E3(DQ0) U12.F2(DQ2) U12.F7(DQ1) U12.F8(DQ3) U12.G2(DQ6) U12.H3(DQ4) U12.H7(DQ7) ; also sheet 3
DDR_DQM0: U12.E7(LDM) ; also sheet 3
DDR_DQM1: U12.D3(UDM) ; also sheet 3
DDR_DQS0: U12.F3(LDQS) ; also sheet 3
DDR_DQS1: U12.C7(UDQS) ; also sheet 3
DDR_DQSN0: U12.G3(LDQSN) ; also sheet 3
DDR_DQSN1: U12.B7(UDQSN) ; also sheet 3
DDR_ODT: U12.K1(ODT) ; also sheet 3
DDR_RASN: U12.J3(RASN) ; also sheet 3
DDR_RESETN: R97.2 U12.T2(RESET#) ; also sheet 3
DDR_WEN: U12.L3(WEN) ; also sheet 3
GND: C107.2 C108.2 C109.2 C110.2 C111.2 C112.2 C113.2 C114.2 C115.2 C116.2 C117.2 C118.2 C119.2 C120.2 C121.2 C122.2 C123.2 C124.2 R96.1 R99.2 R100.1 U12.A9(VSS1) U12.B1(VSSQ1) U12.B3(VSS2) U12.B9(VSSQ2) U12.D1(VSSQ3) U12.D8(VSSQ4) U12.E1(VSS3) U12.E2(VSSQ5) U12.E8(VSSQ6) U12.F9(VSSQ7) U12.G1(VSSQ8) U12.G8(VSS4) U12.G9(VSSQ9) U12.J2(VSS5) U12.J8(VSS6) U12.M1(VSS7) U12.M9(VSS8) U12.P1(VSS9) U12.P9(VSS10) U12.T1(VSS11) U12.T9(VSS12) ; supply symbol labelled DGND ; also sheet 2,3,4,5,6,8,9,10,11
N$484: U12.H8(DQ5)
N$514: R99.1 U12.L8(ZQ)
VCC: C107.1 C108.1 C109.1 C110.1 C111.1 C112.1 C113.1 C114.1 C115.1 C116.1 C117.1 C118.1 C119.1 C120.1 C121.1 C122.1 C123.1 C124.1 R97.1 R98.1 R98.2 R100.2 U12.A1(VDDQ1) U12.A8(VDDQ2) U12.B2(VDD1) U12.C1(VDDQ3) U12.C9(VDDQ4) U12.D2(VDDQ5) U12.D9(VDD9) U12.E9(VDDQ7) U12.F1(VDDQ8) U12.G7(VDD2) U12.H1(VREF_DQ) U12.H2(VDDQ9) U12.H9(VDDQ10) U12.K2(VDD4) U12.K8(VDD5) U12.M8(VREF_CA) U12.N1(VDD6) U12.N9(VDD7) U12.R1(VDD8) U12.R9(VDD3) ; supply symbol labelled VDDS_DDR, DDR_VREF ; also sheet 2,3,4,5,6,8,9,10,11
Unconnected: U12.J1(NC1) U12.J9(NC2) U12.L1(NC3) U12.L9(NC4)

### Notes on the sheet
- 10K,1%
- 1.5K,1%
- DDR3L SDRAM
- DDR_A0
- DDR_A1
- DDR_A2
- DDR_A3
- DDR_A4
- DDR_A5
- DDR_A6
- DDR_A7
- DDR_A8
- DDR_D0 | DDR_A9
- DDR_D1 | DDR_A10
- DDR_D2 | DDR_A11
- DDR_D3 | DDR_A12
- DDR_D4 | DDR_A13
- DDR_D5 | DDR_A14
- DDR_D6 | DDR_A15
- DDR_D7 | DDR_BA0
- DDR_D8 | DDR_BA1
- DDR_D9 | DDR_BA2
- DDR_D10
- DDR_D11
- DDR_D12
- DDR_D13
- DDR_D14
- DDR_D15
- 0.1uf,6.3V | 0.1uf,6.3V | 0.1uf,6.3V | 0.1uf,6.3V | 0.1uf,6.3V | 0.1uf,6.3V | 0.1uf,6.3V | 0.1uf,6.3V | 0.1uf,6.3V | 0.1uf,6.3V | 0.1uf,6.3V
- 10K,1% | 10uF,10V | 10uF,10V
- 240 | 0.1uf,6.3V | 0.1uf,6.3V | 0.1uf,6.3V
- D2516EC4BXGGB
- 0.001uf,50V | 10K,1%
- 0.1uf,6.3V | 4Gb DDR3
- Title: BeagleBone Black DDR3 Memory
- 450-5500-001 | C

## Sheet 8 of 11
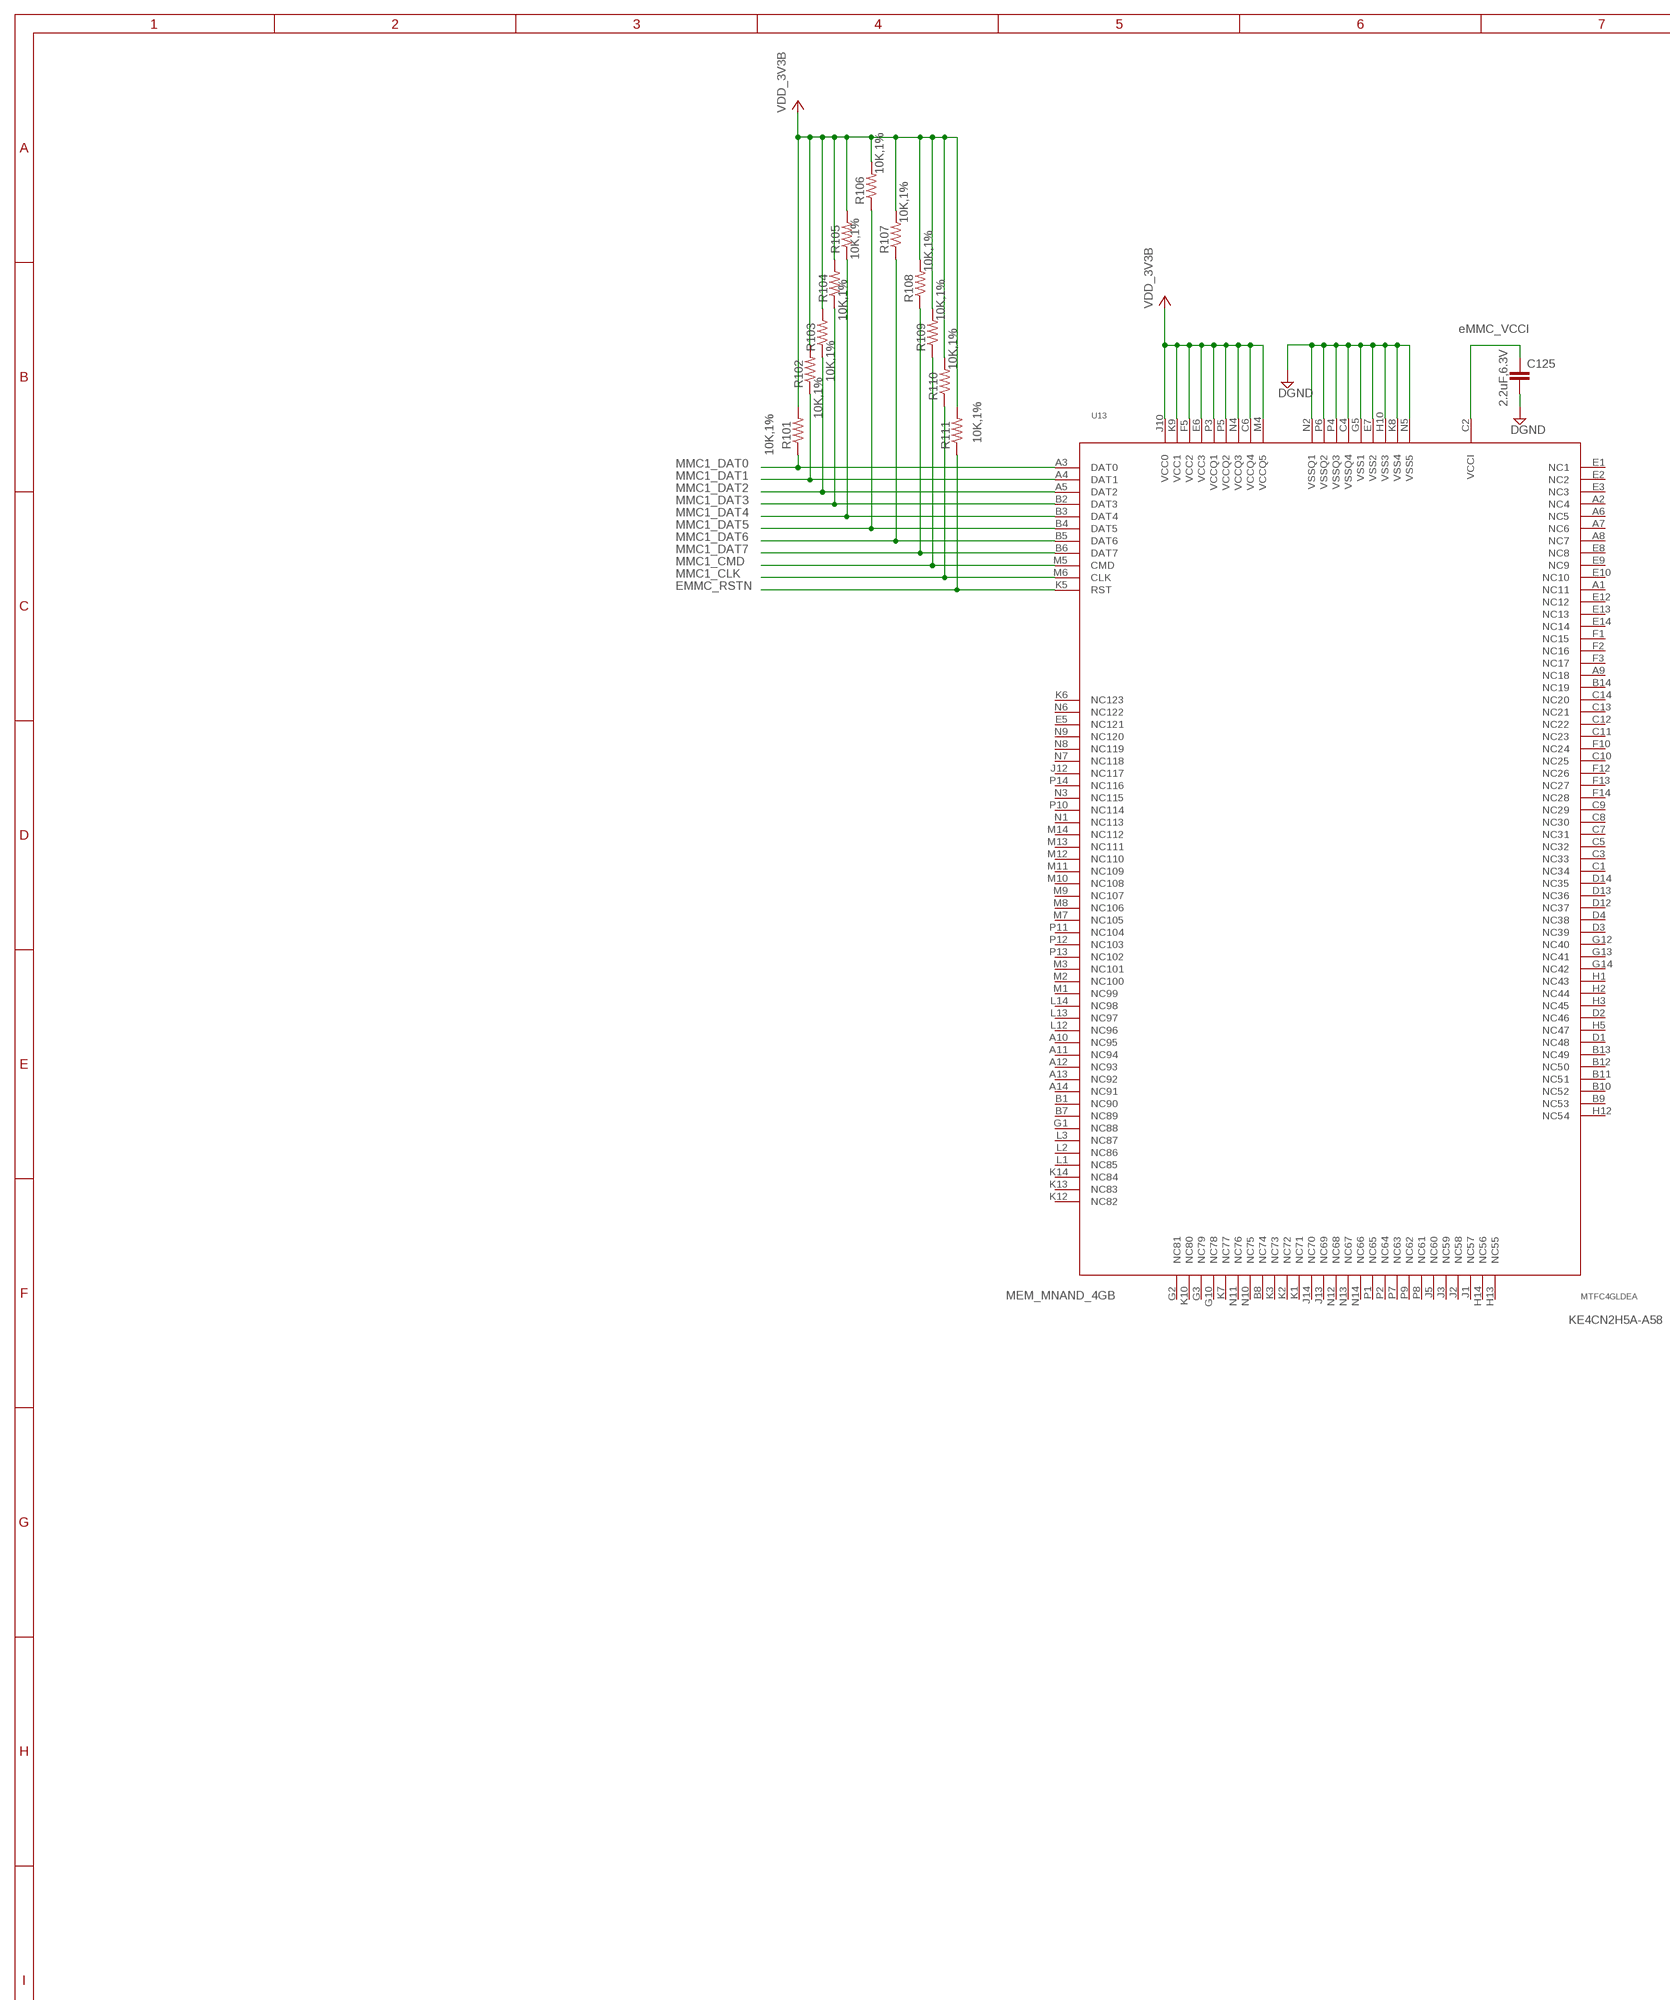
[diagram p12: schematic, sheet 8, part 1 of 2]
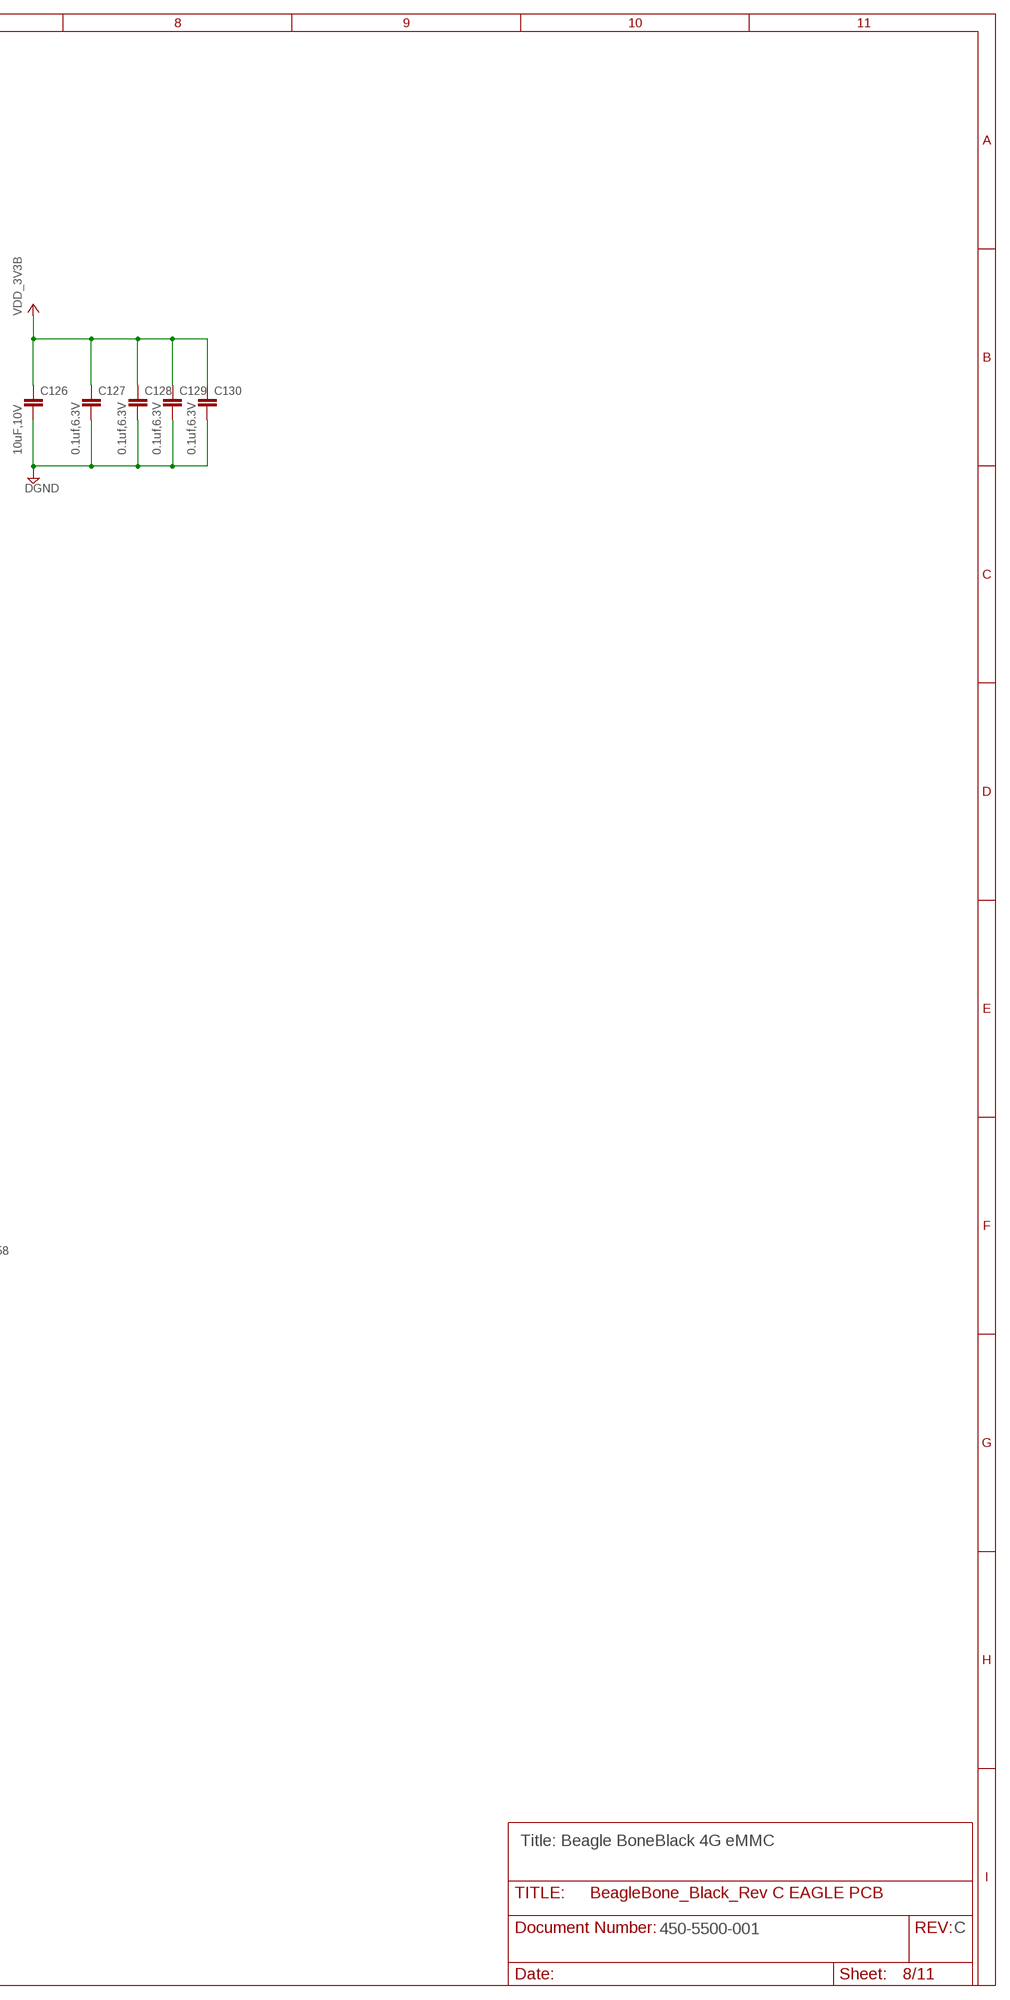
[diagram p13: schematic, sheet 8, part 2 of 2]

### Parts
C125  C-EUC0402  [C0402]
C126  C-EUC0805  [C0805]
C127  C-EUC0402  [C0402]
C128  C-EUC0402  [C0402]
C129  C-EUC0402  [C0402]
C130  C-EUC0402  [C0402]
R101  R-US_R0402  [R0402]
R102  R-US_R0402  [R0402]
R103  R-US_R0402  [R0402]
R104  R-US_R0402  [R0402]
R105  R-US_R0402  [R0402]
R106  R-US_R0402  [R0402]
R107  R-US_R0402  [R0402]
R108  R-US_R0402  [R0402]
R109  R-US_R0402  [R0402]
R110  R-US_R0402  [R0402]
R111  R-US_R0402  [R0402]
U13  MTFC4GLDEA  [MTFC4GLDEA]

### Nets
EMMC_RSTN: R111.1 U13.K5(RST) ; also sheet 3
GND: C125.2 C126.2 C127.2 C128.2 C129.2 C130.2 U13.C4(VSSQ4) U13.E7(VSS2) U13.G5(VSS1) U13.H10(VSS3) U13.K8(VSS4) U13.N2(VSSQ1) U13.N5(VSS5) U13.P4(VSSQ3) U13.P6(VSSQ2) ; supply symbol labelled DGND ; also sheet 2,3,4,5,6,7,9,10,11
MMC1_CLK: R110.1 U13.M6(CLK) ; also sheet 3,11
MMC1_CMD: R109.1 U13.M5(CMD) ; also sheet 3,11
MMC1_DAT0: R101.1 U13.A3(DAT0) ; also sheet 3,11
MMC1_DAT1: R102.1 U13.A4(DAT1) ; also sheet 3,11
MMC1_DAT2: R103.1 U13.A5(DAT2) ; also sheet 3,11
MMC1_DAT3: R104.1 U13.B2(DAT3) ; also sheet 3,11
MMC1_DAT4: R105.1 U13.B3(DAT4) ; also sheet 3,11
MMC1_DAT5: R106.1 U13.B4(DAT5) ; also sheet 3,11
MMC1_DAT6: R107.1 U13.B5(DAT6) ; also sheet 3,11
MMC1_DAT7: R108.1 U13.B6(DAT7) ; also sheet 3,11
N$466: C125.1 U13.C2(VCCI)
N$467: C126.1 C127.1 C128.1 C129.1 C130.1
VCC: R101.2 R102.2 R103.2 R104.2 R105.2 R106.2 R107.2 R108.2 R109.2 R110.2 R111.2 U13.C6(VCCQ4) U13.E6(VCC3) U13.F5(VCC2) U13.J10(VCC0) U13.K9(VCC1) U13.M4(VCCQ5) U13.N4(VCCQ3) U13.P3(VCCQ1) U13.P5(VCCQ2) ; supply symbol labelled VDD_3V3B ; also sheet 2,3,4,5,6,7,9,10,11
Unconnected: U13.A1(NC11) U13.A2(NC4) U13.A6(NC5) U13.A7(NC6) U13.A8(NC7) U13.A9(NC18) U13.A10(NC95) U13.A11(NC94) U13.A12(NC93) U13.A13(NC92) U13.A14(NC91) U13.B1(NC90) U13.B7(NC89) U13.B8(NC74) U13.B9(NC53) U13.B10(NC52) U13.B11(NC51) U13.B12(NC50) U13.B13(NC49) U13.B14(NC19) U13.C1(NC34) U13.C3(NC33) U13.C5(NC32) U13.C7(NC31) U13.C8(NC30) U13.C9(NC29) U13.C10(NC25) U13.C11(NC23) U13.C12(NC22) U13.C13(NC21) U13.C14(NC20) U13.D1(NC48) U13.D2(NC46) U13.D3(NC39) U13.D4(NC38) U13.D12(NC37) U13.D13(NC36) U13.D14(NC35) U13.E1(NC1) U13.E2(NC2) U13.E3(NC3) U13.E5(NC121) U13.E8(NC8) U13.E9(NC9) U13.E10(NC10) U13.E12(NC12) U13.E13(NC13) U13.E14(NC14) U13.F1(NC15) U13.F2(NC16) U13.F3(NC17) U13.F10(NC24) U13.F12(NC26) U13.F13(NC27) U13.F14(NC28) U13.G1(NC88) U13.G2(NC81) U13.G3(NC79) U13.G10(NC78) U13.G12(NC40) U13.G13(NC41) U13.G14(NC42) U13.H1(NC43) U13.H2(NC44) U13.H3(NC45) U13.H5(NC47) U13.H12(NC54) U13.H13(NC55) U13.H14(NC56) U13.J1(NC57) U13.J2(NC58) U13.J3(NC59) U13.J5(NC60) U13.J12(NC117) U13.J13(NC69) U13.J14(NC70) U13.K1(NC71) U13.K2(NC72) U13.K3(NC73) U13.K6(NC123) U13.K7(NC77) U13.K10(NC80) U13.K12(NC82) U13.K13(NC83) U13.K14(NC84) U13.L1(NC85) U13.L2(NC86) U13.L3(NC87) U13.L12(NC96) U13.L13(NC97) U13.L14(NC98) U13.M1(NC99) U13.M2(NC100) U13.M3(NC101) U13.M7(NC105) U13.M8(NC106) U13.M9(NC107) U13.M10(NC108) U13.M11(NC109) U13.M12(NC110) U13.M13(NC111) U13.M14(NC112) U13.N1(NC113) U13.N3(NC115) U13.N6(NC122) U13.N7(NC118) U13.N8(NC119) U13.N9(NC120) U13.N10(NC75) U13.N11(NC76) U13.N12(NC68) U13.N13(NC67) U13.N14(NC66) U13.P1(NC65) U13.P2(NC64) U13.P7(NC63) U13.P8(NC61) U13.P9(NC62) U13.P10(NC114) U13.P11(NC104) U13.P12(NC103) U13.P13(NC102) U13.P14(NC116)

### Notes on the sheet
- 10K,1%
- 10K,1%
- 10K,1%
- 10K,1%
- 10K,1% | 10K,1%
- eMMC_VCCI
- 10K,1%
- 10K,1%
- 2.2uF,6.3V
- 10K,1%
- 10K,1%
- 10K,1%
- 10uF,10V | 0.1uf,6.3V | 0.1uf,6.3V | 0.1uf,6.3V | 0.1uf,6.3V
- MEM_MNAND_4GB
- KE4CN2H5A-A58
- Title: Beagle BoneBlack 4G eMMC
- 450-5500-001 | C